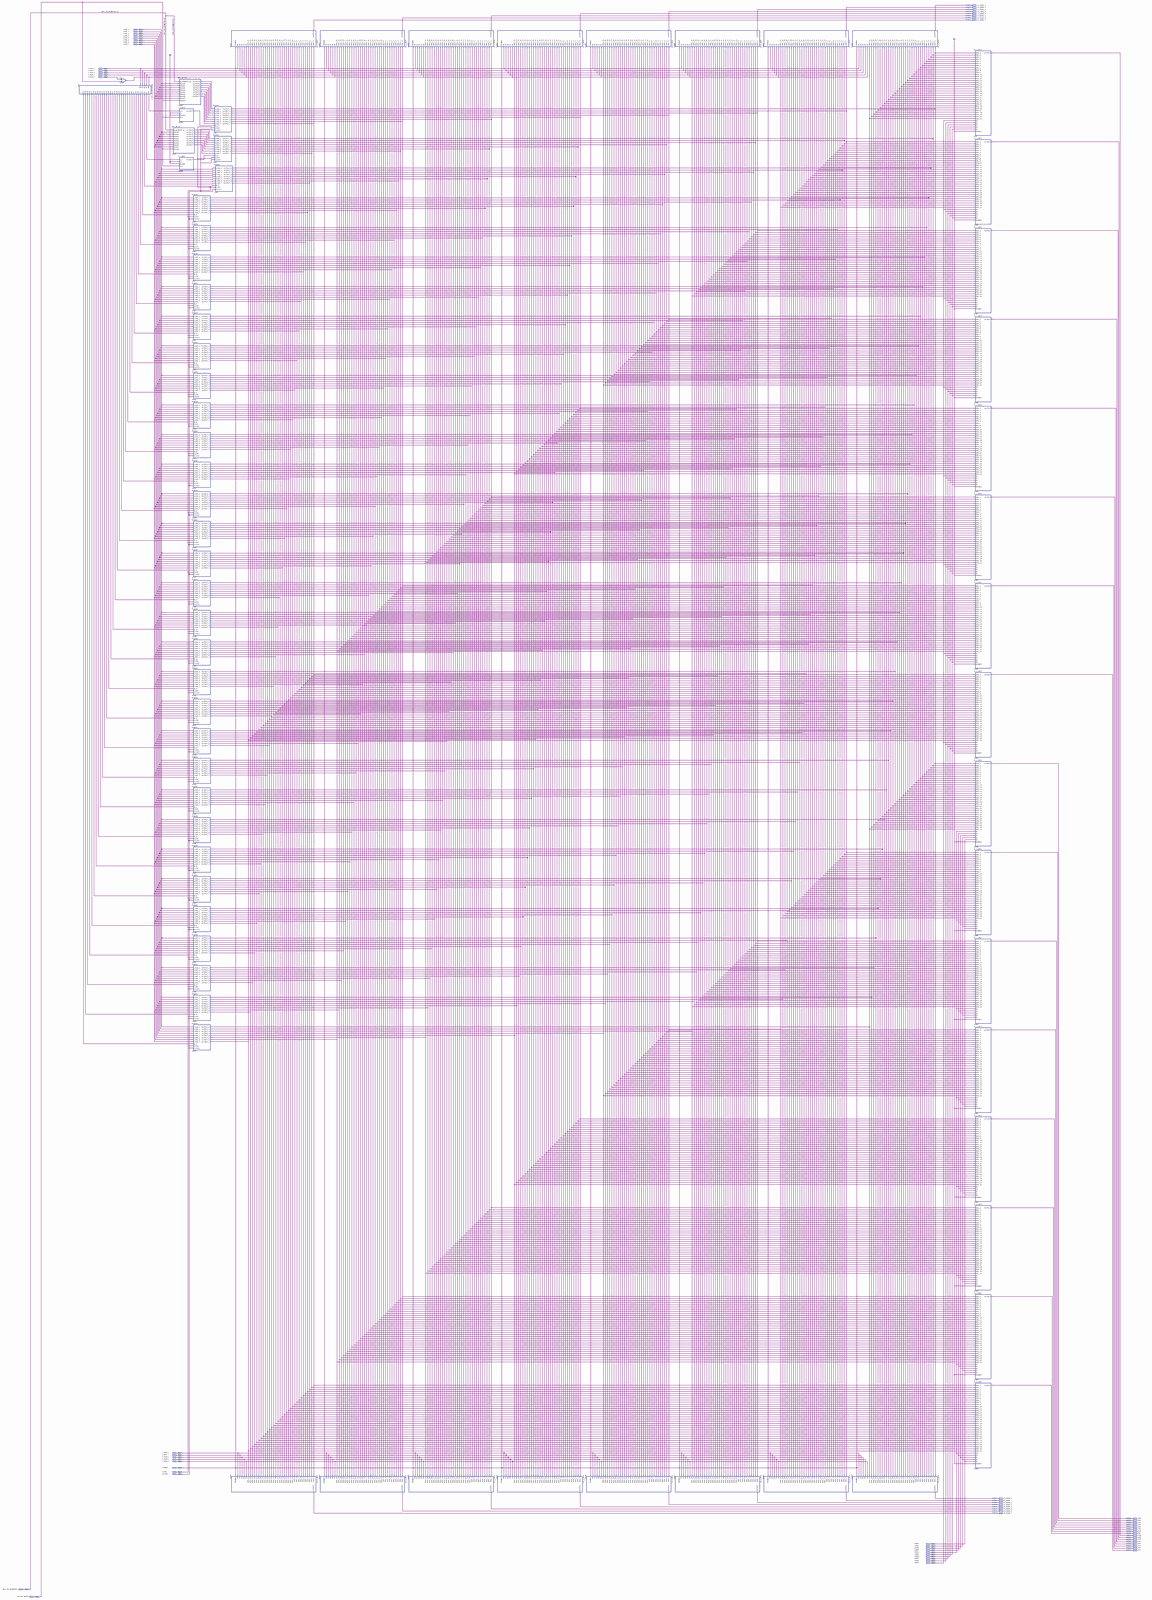
[diagram p0: schematic sheet, whole]
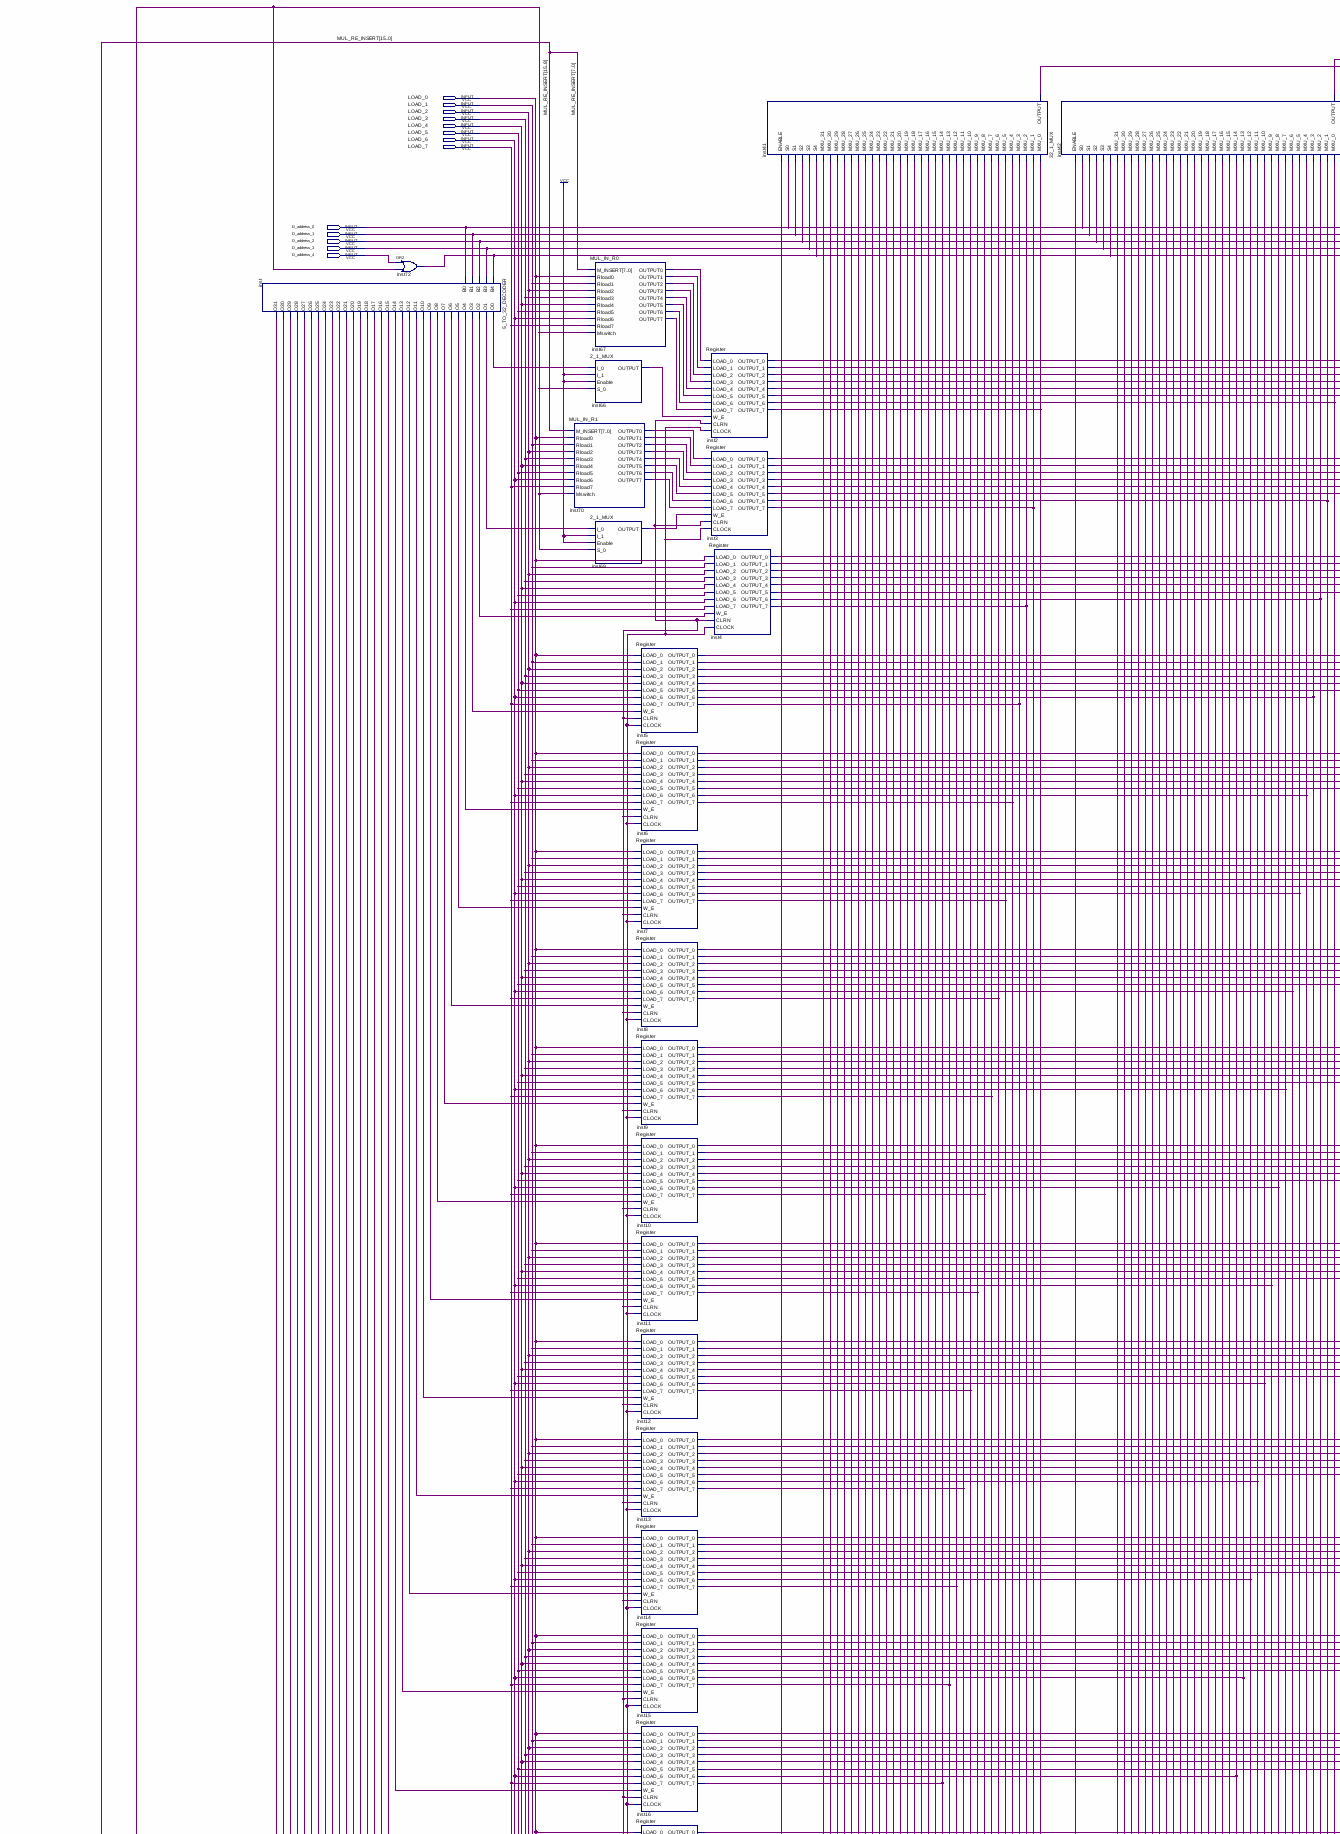
[diagram p1: schematic sheet, upper left part]
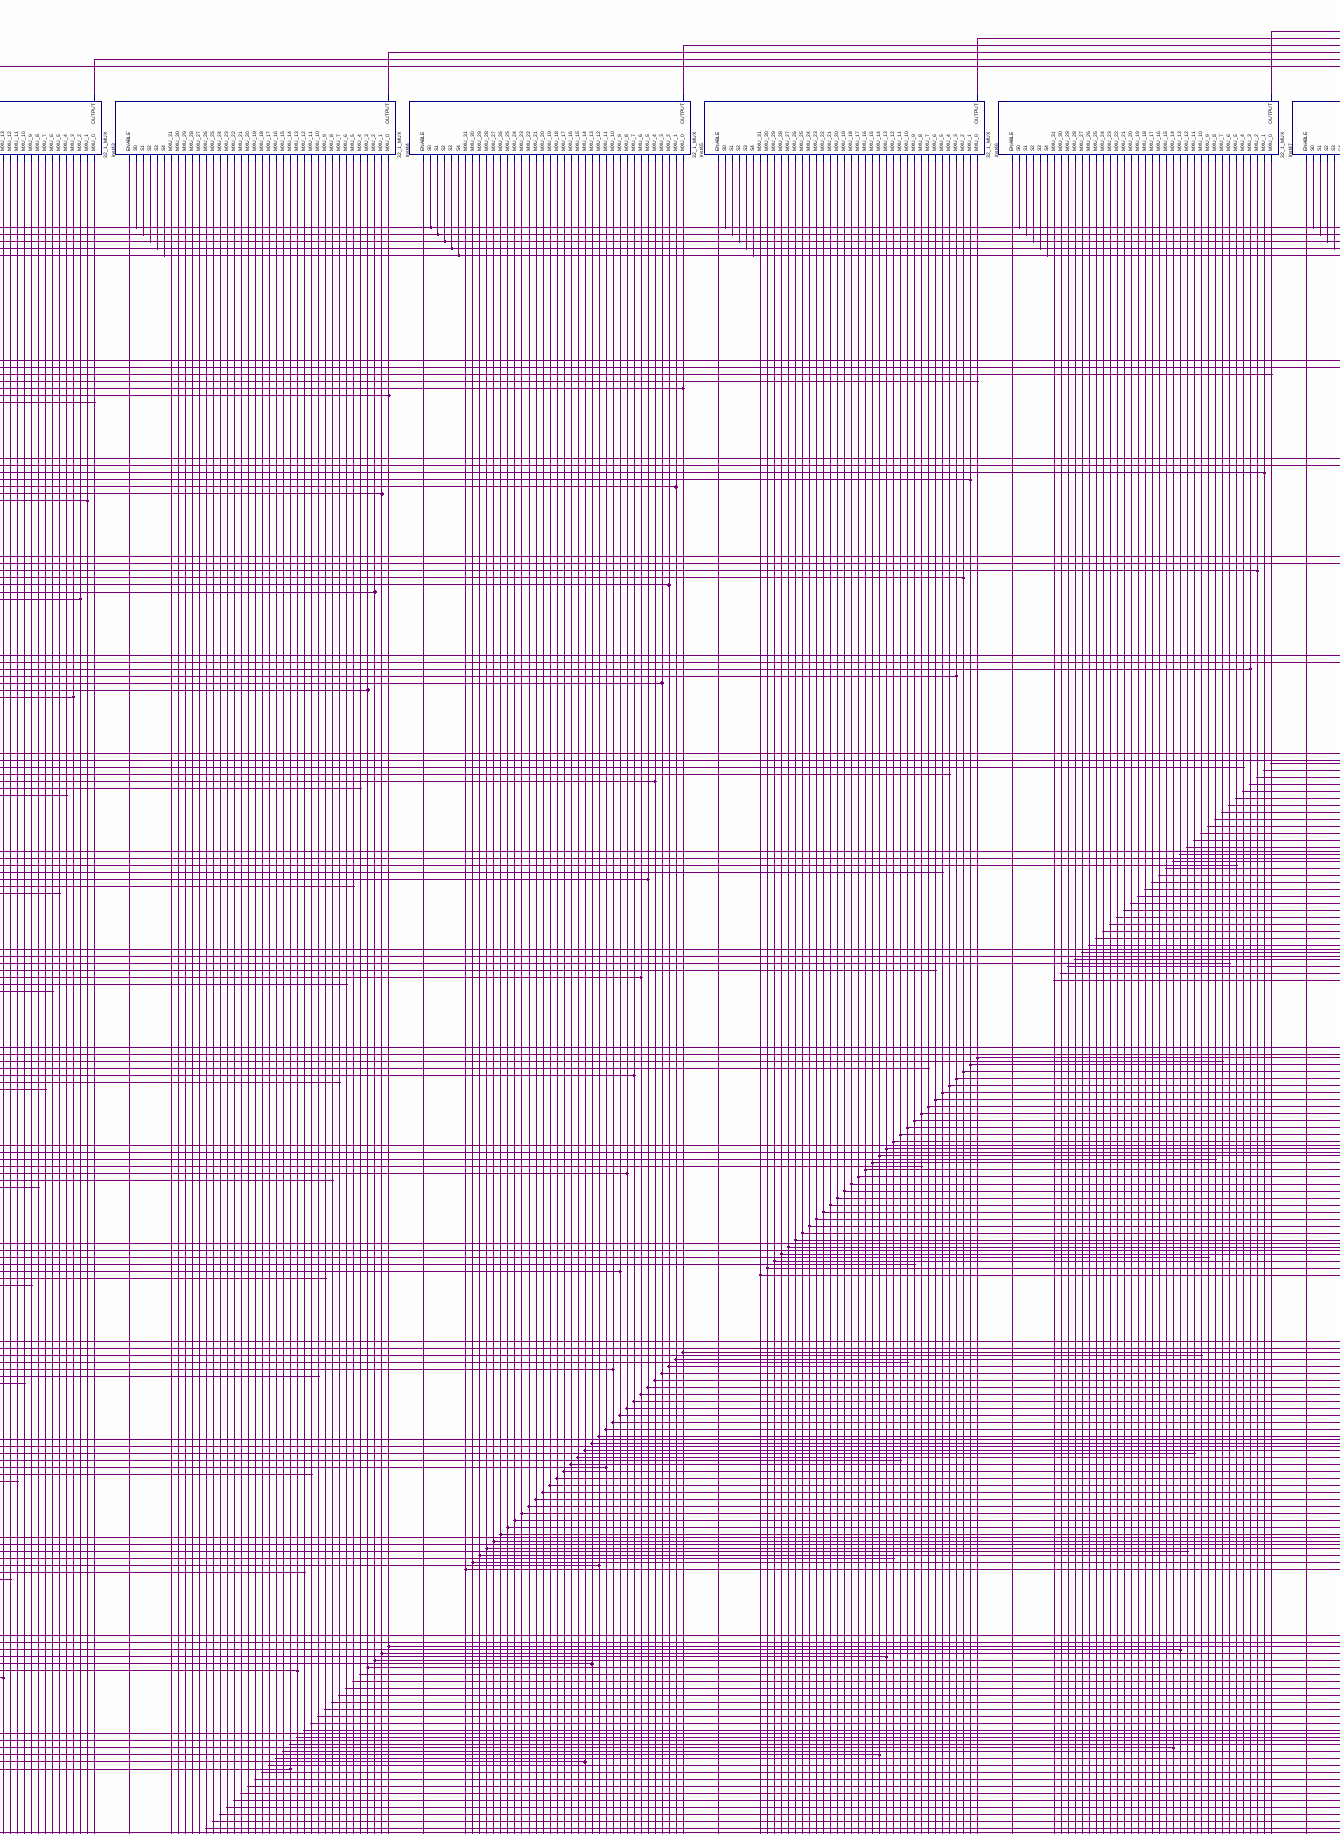
[diagram p2: schematic sheet, upper centre part]
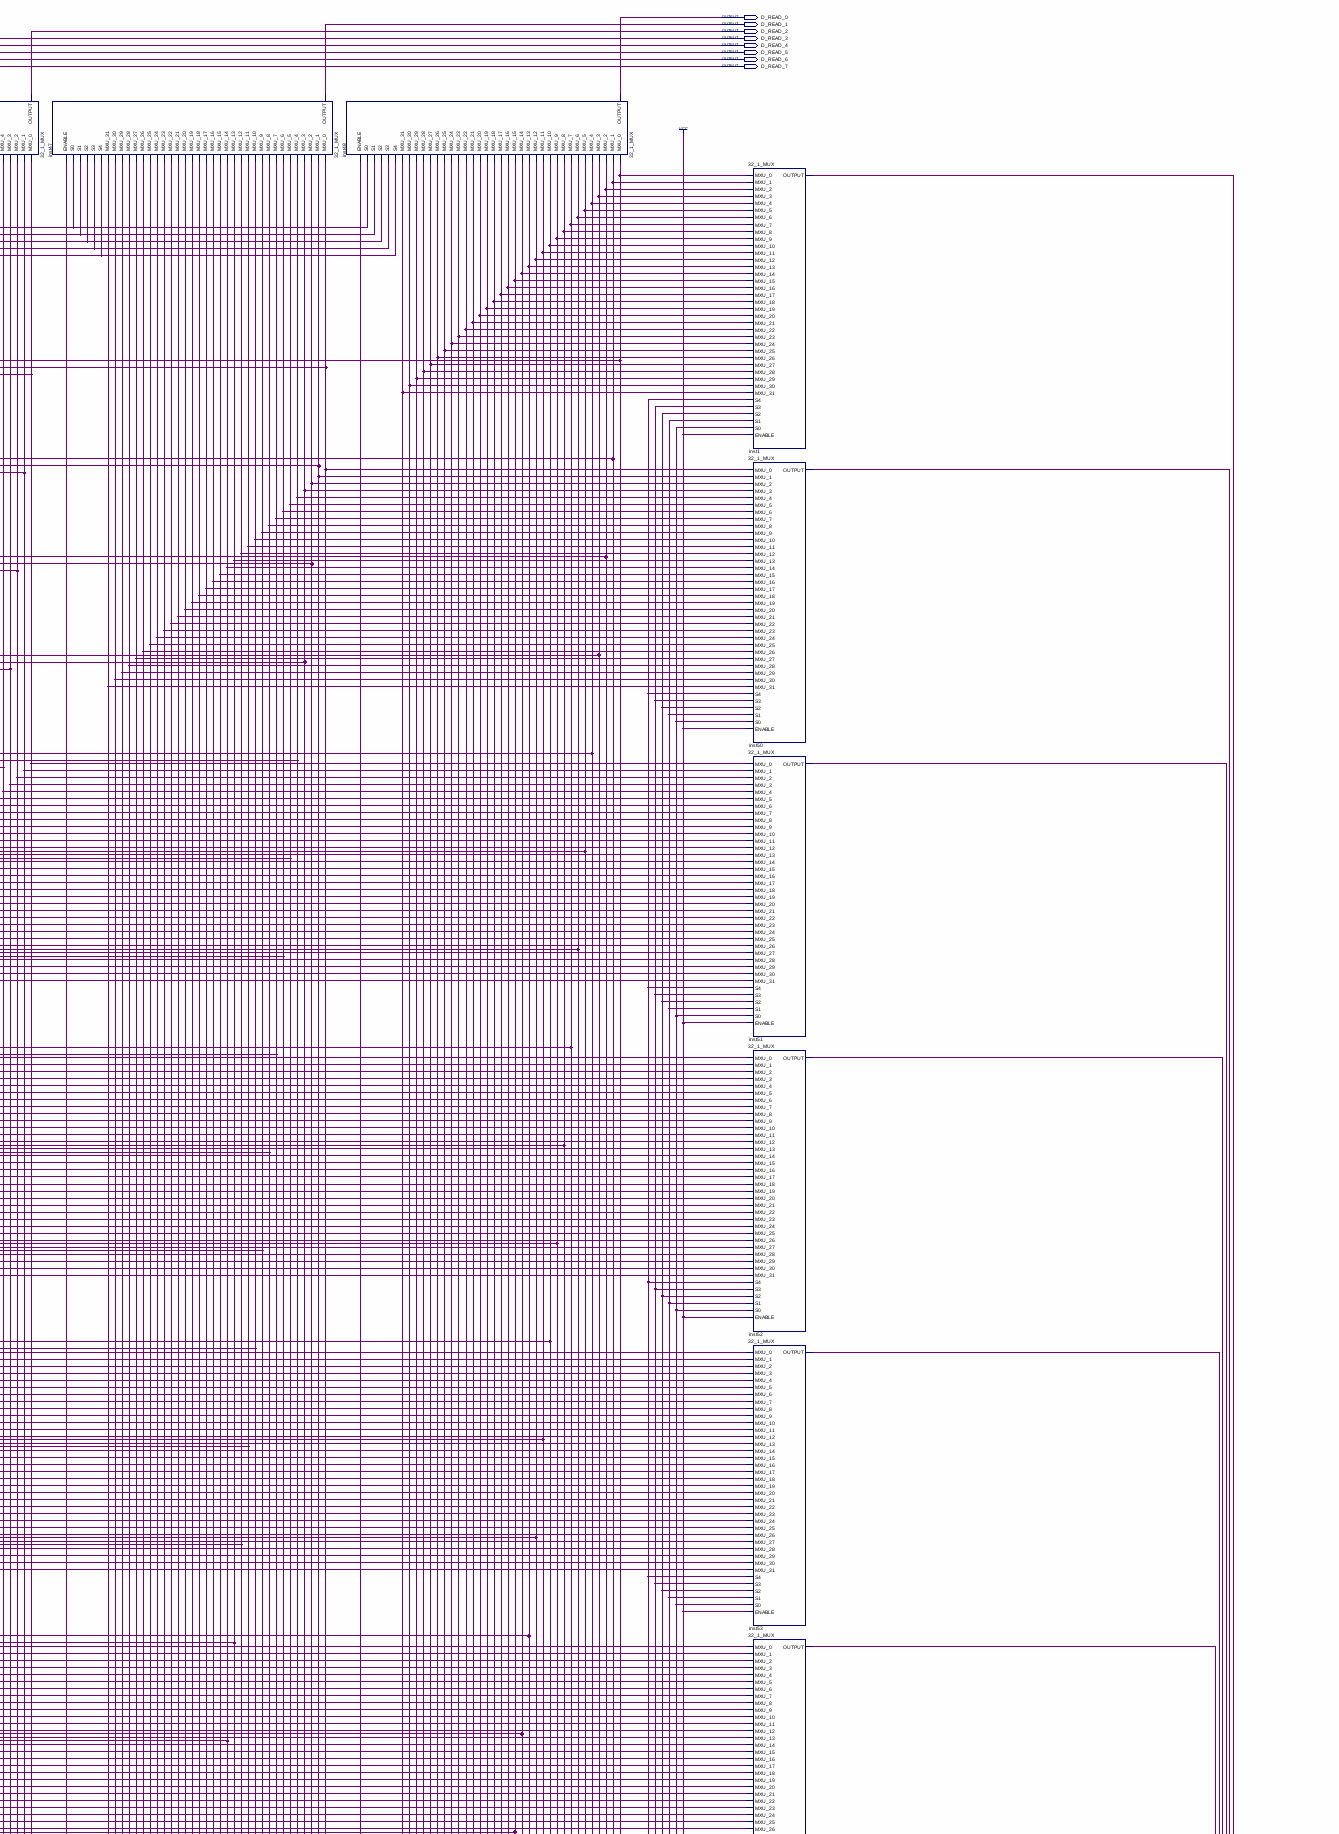
[diagram p3: schematic sheet, upper right part]
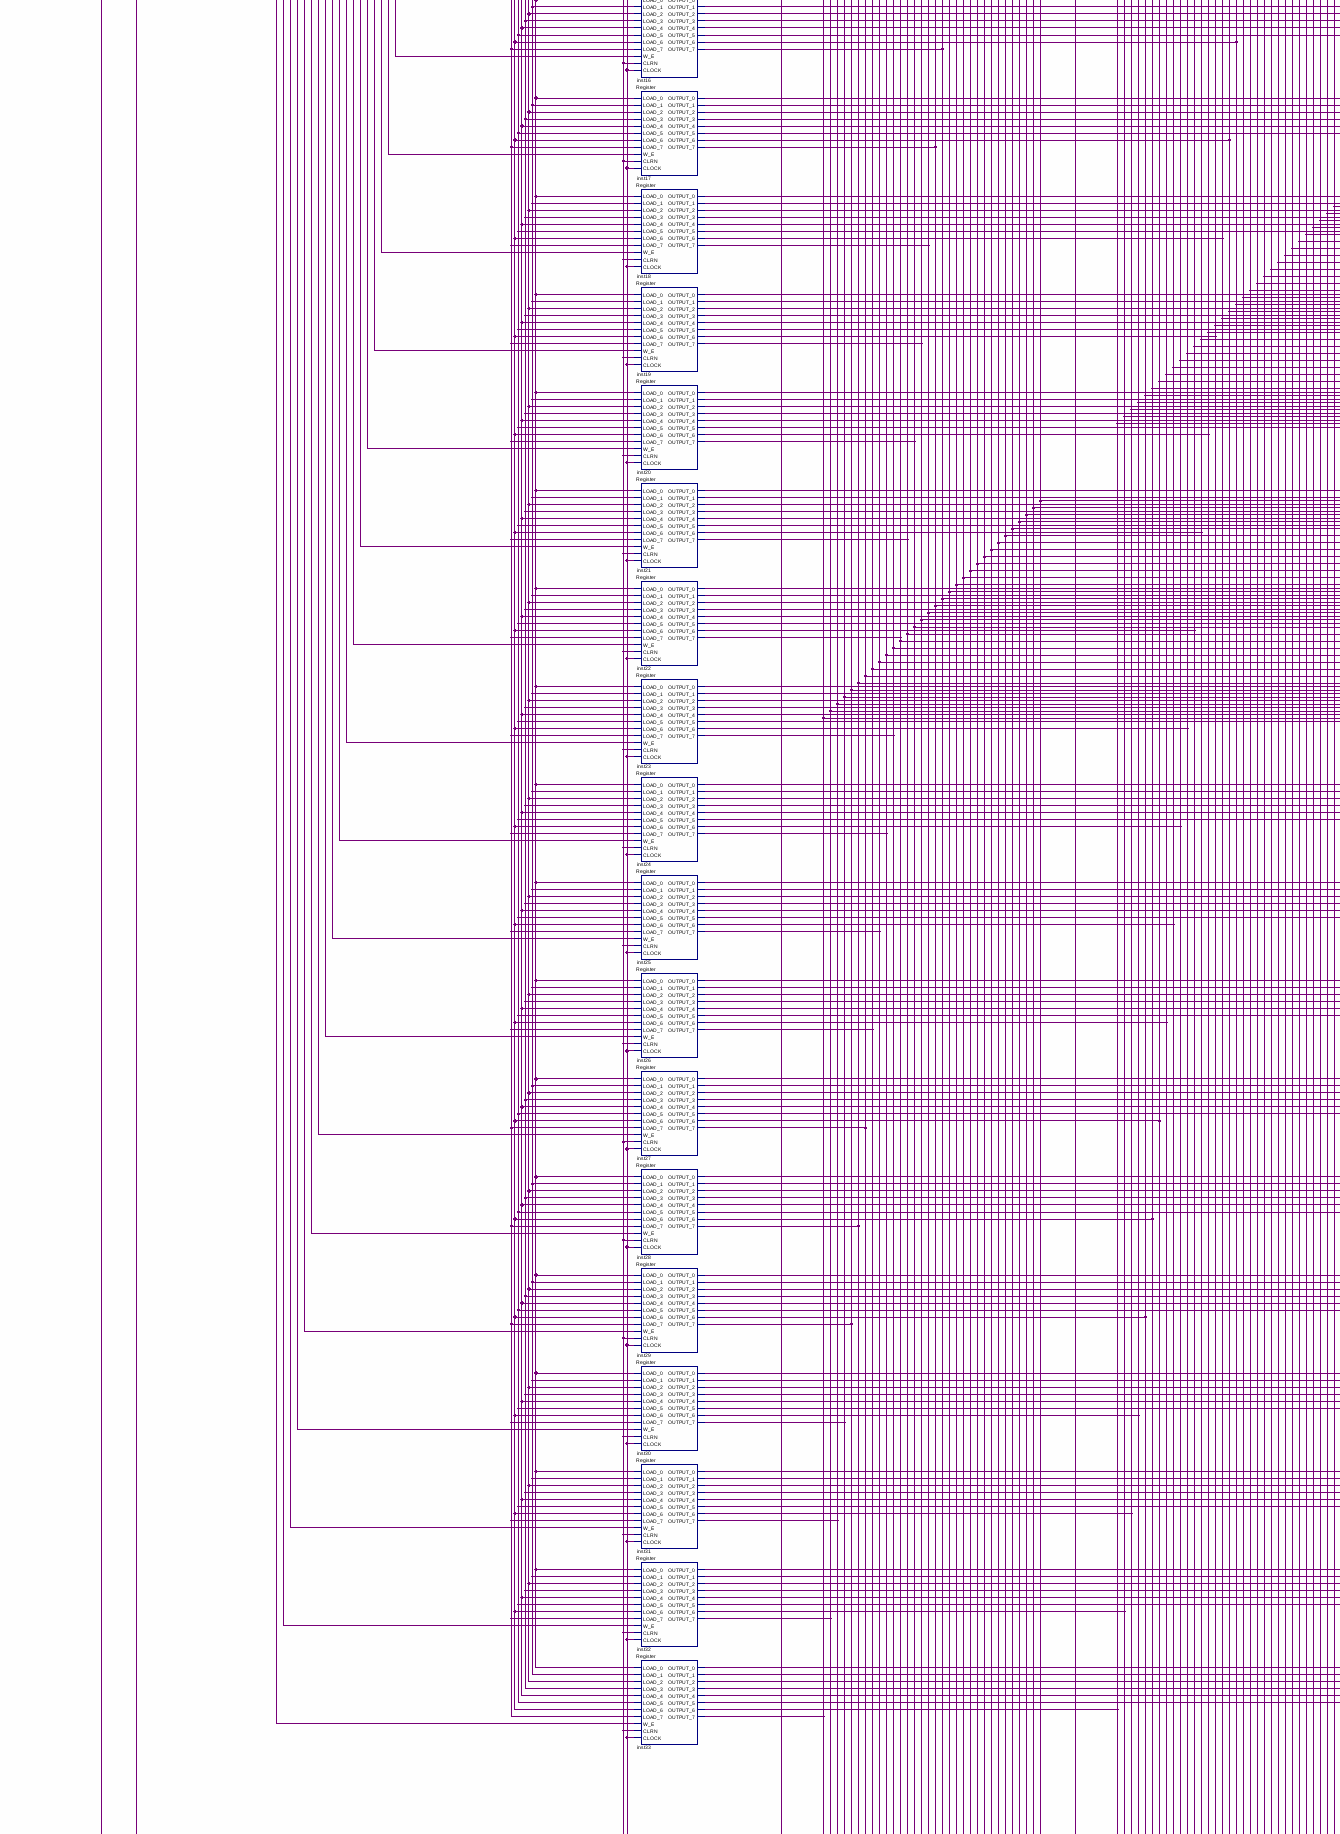
[diagram p4: schematic sheet, middle left part]
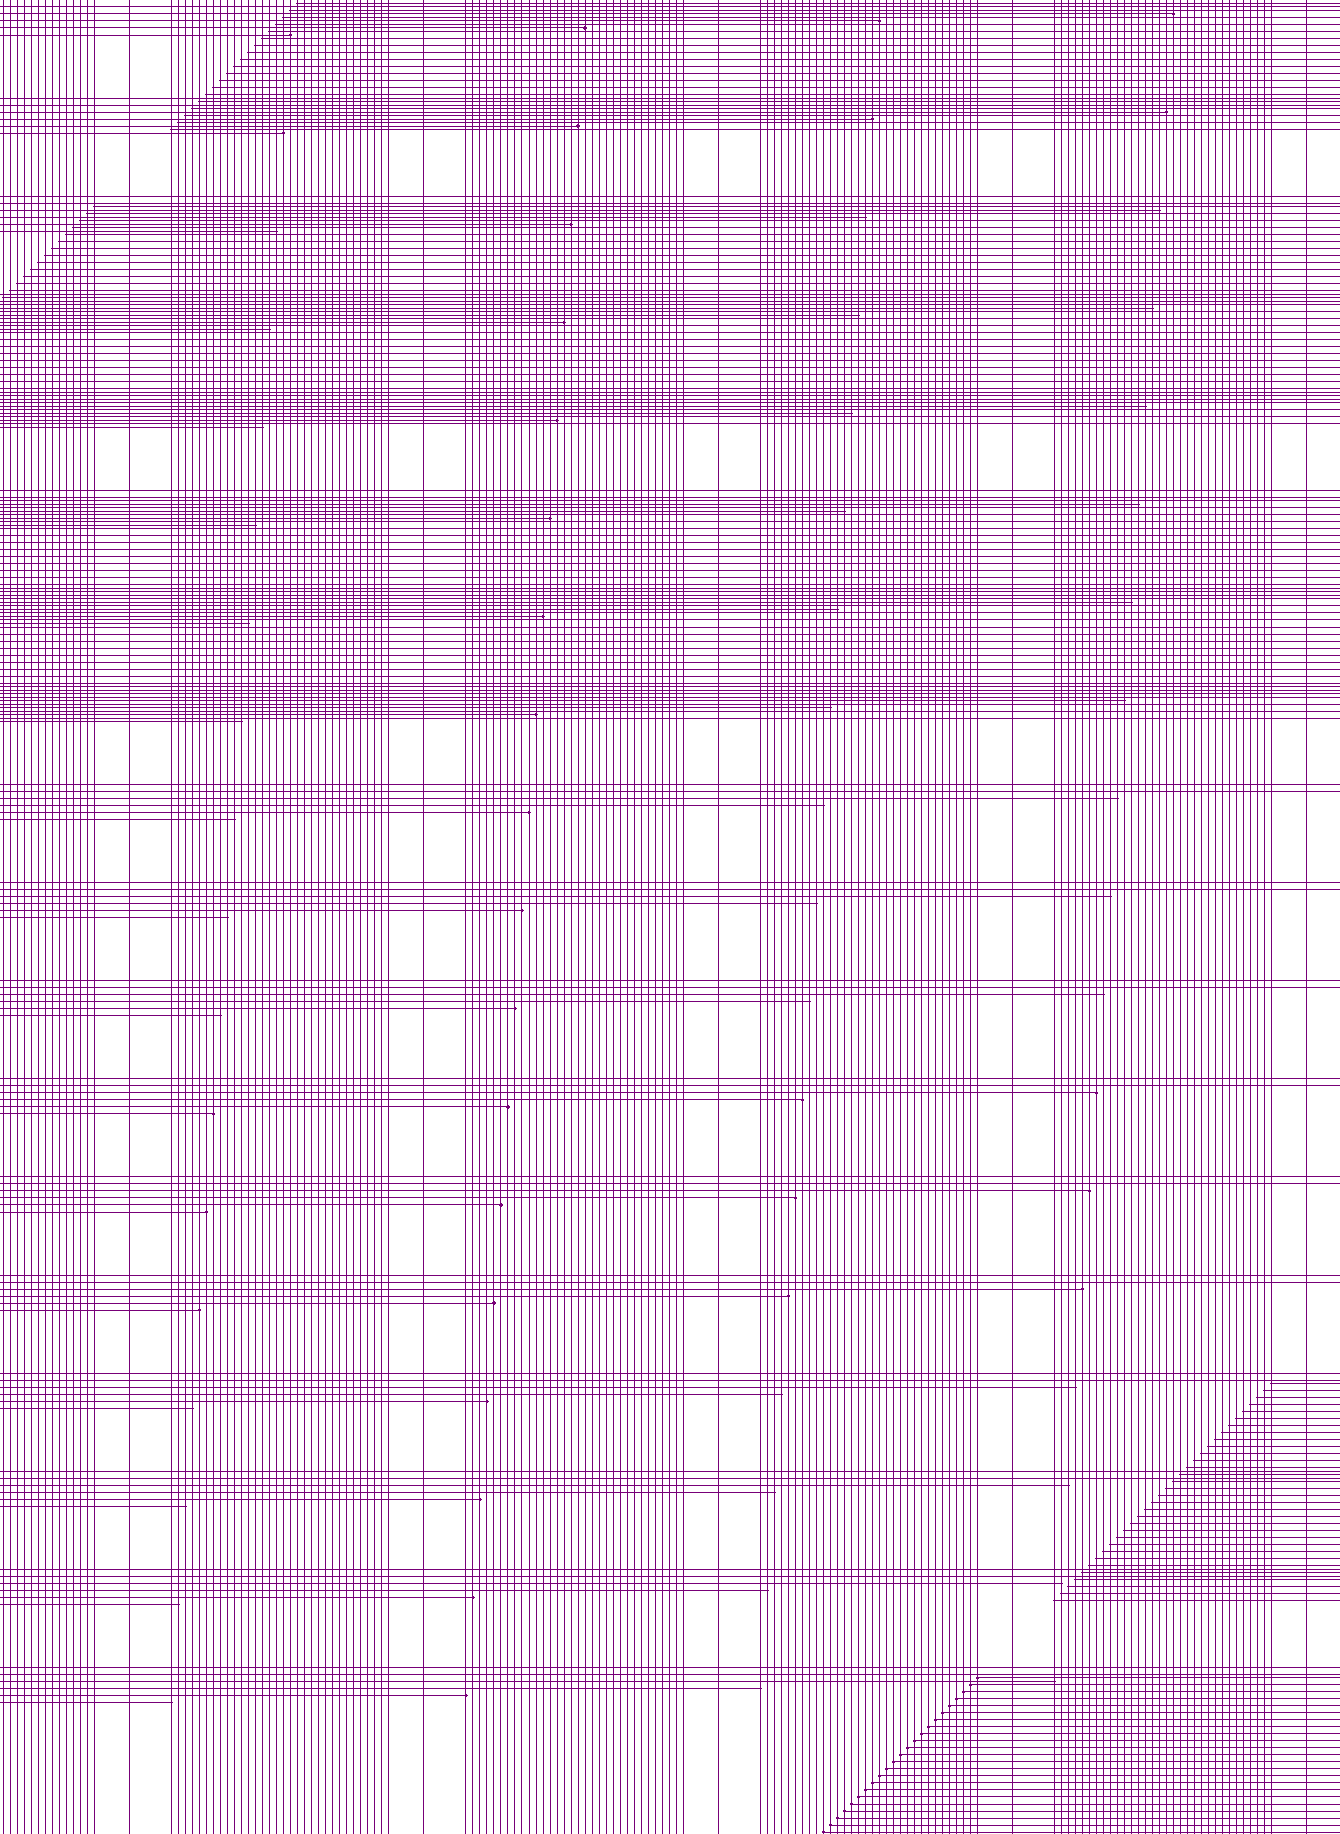
[diagram p5: schematic sheet, middle centre part]
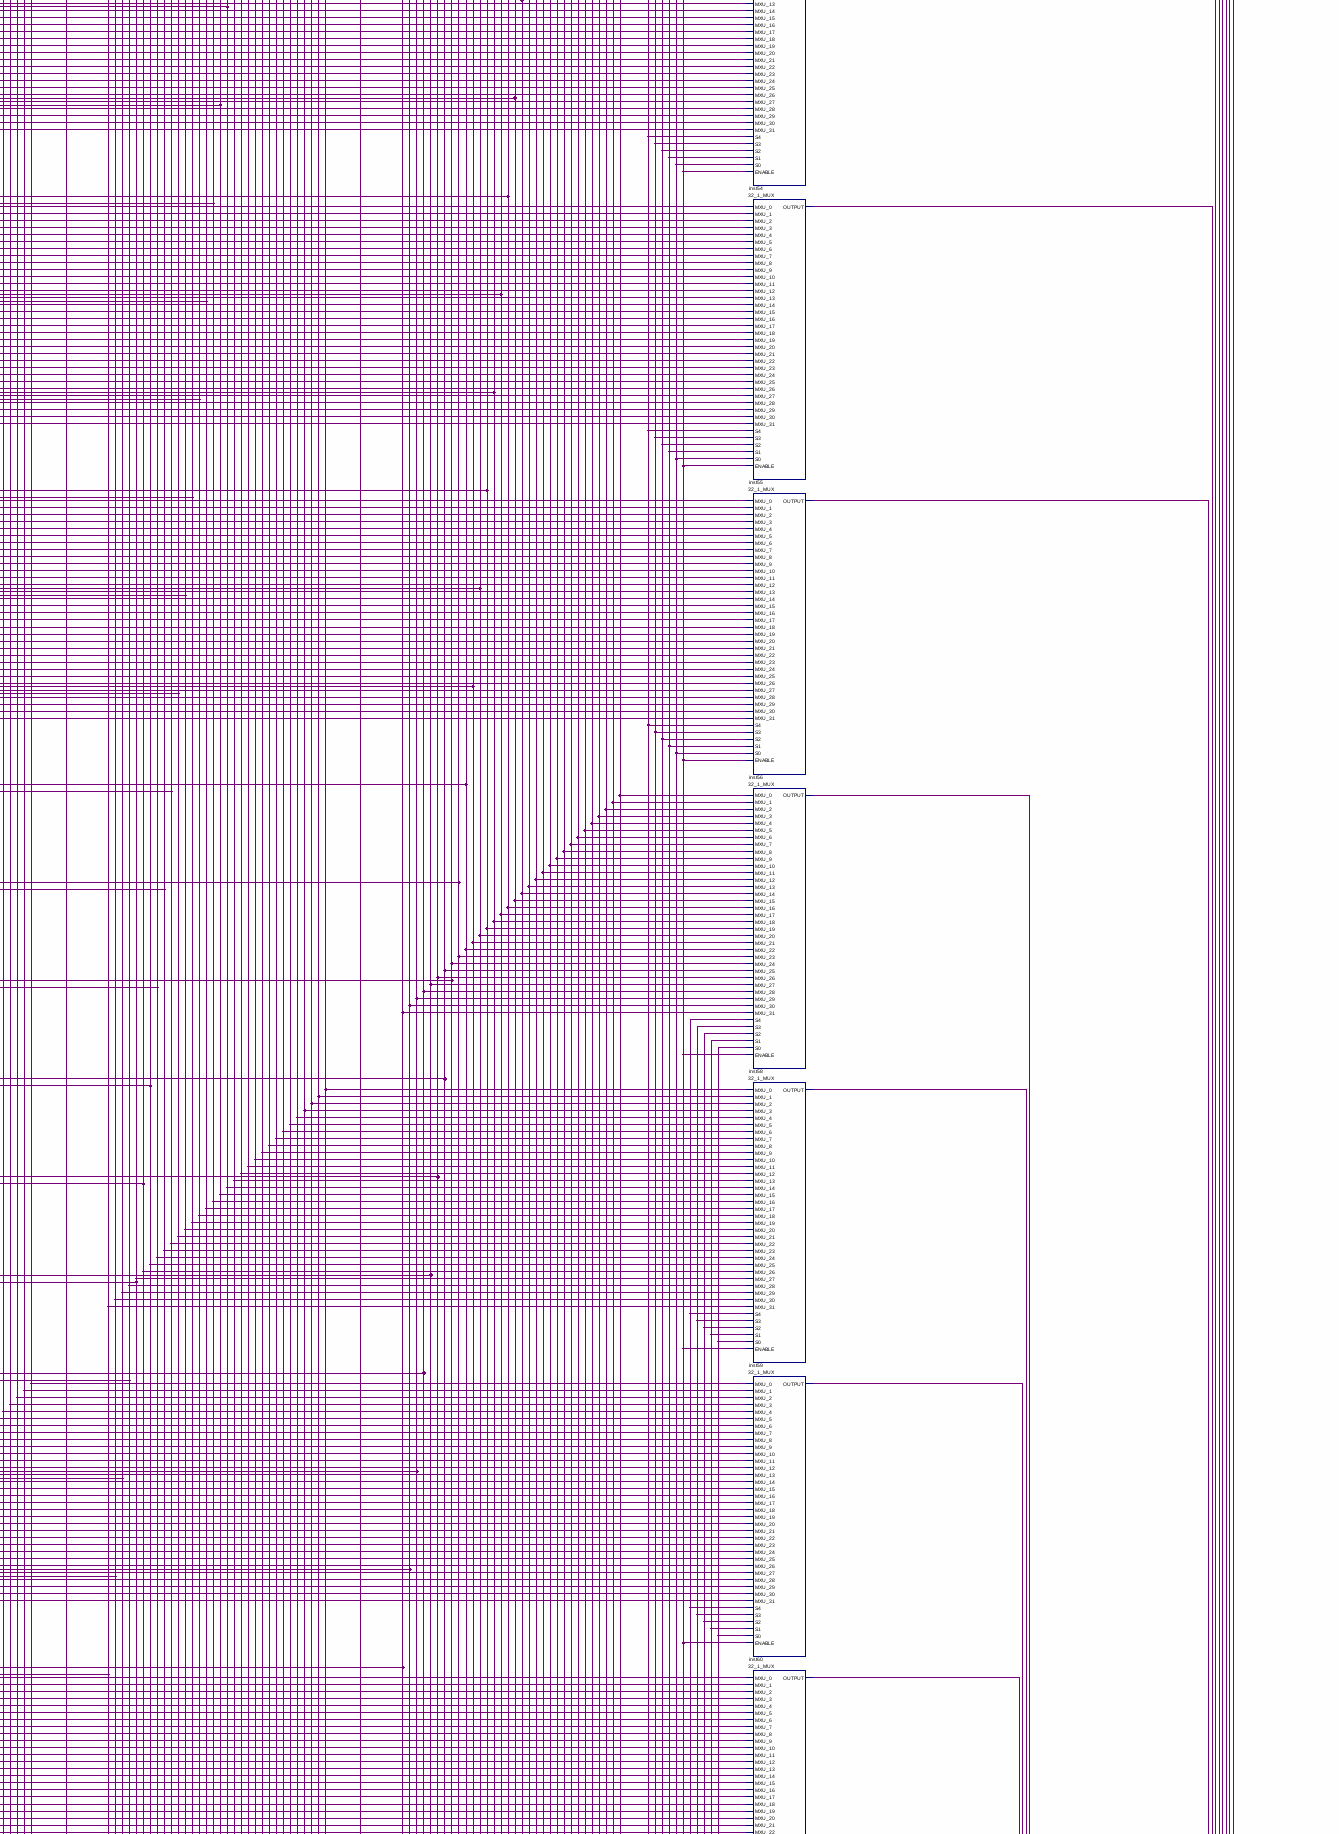
[diagram p6: schematic sheet, middle right part]
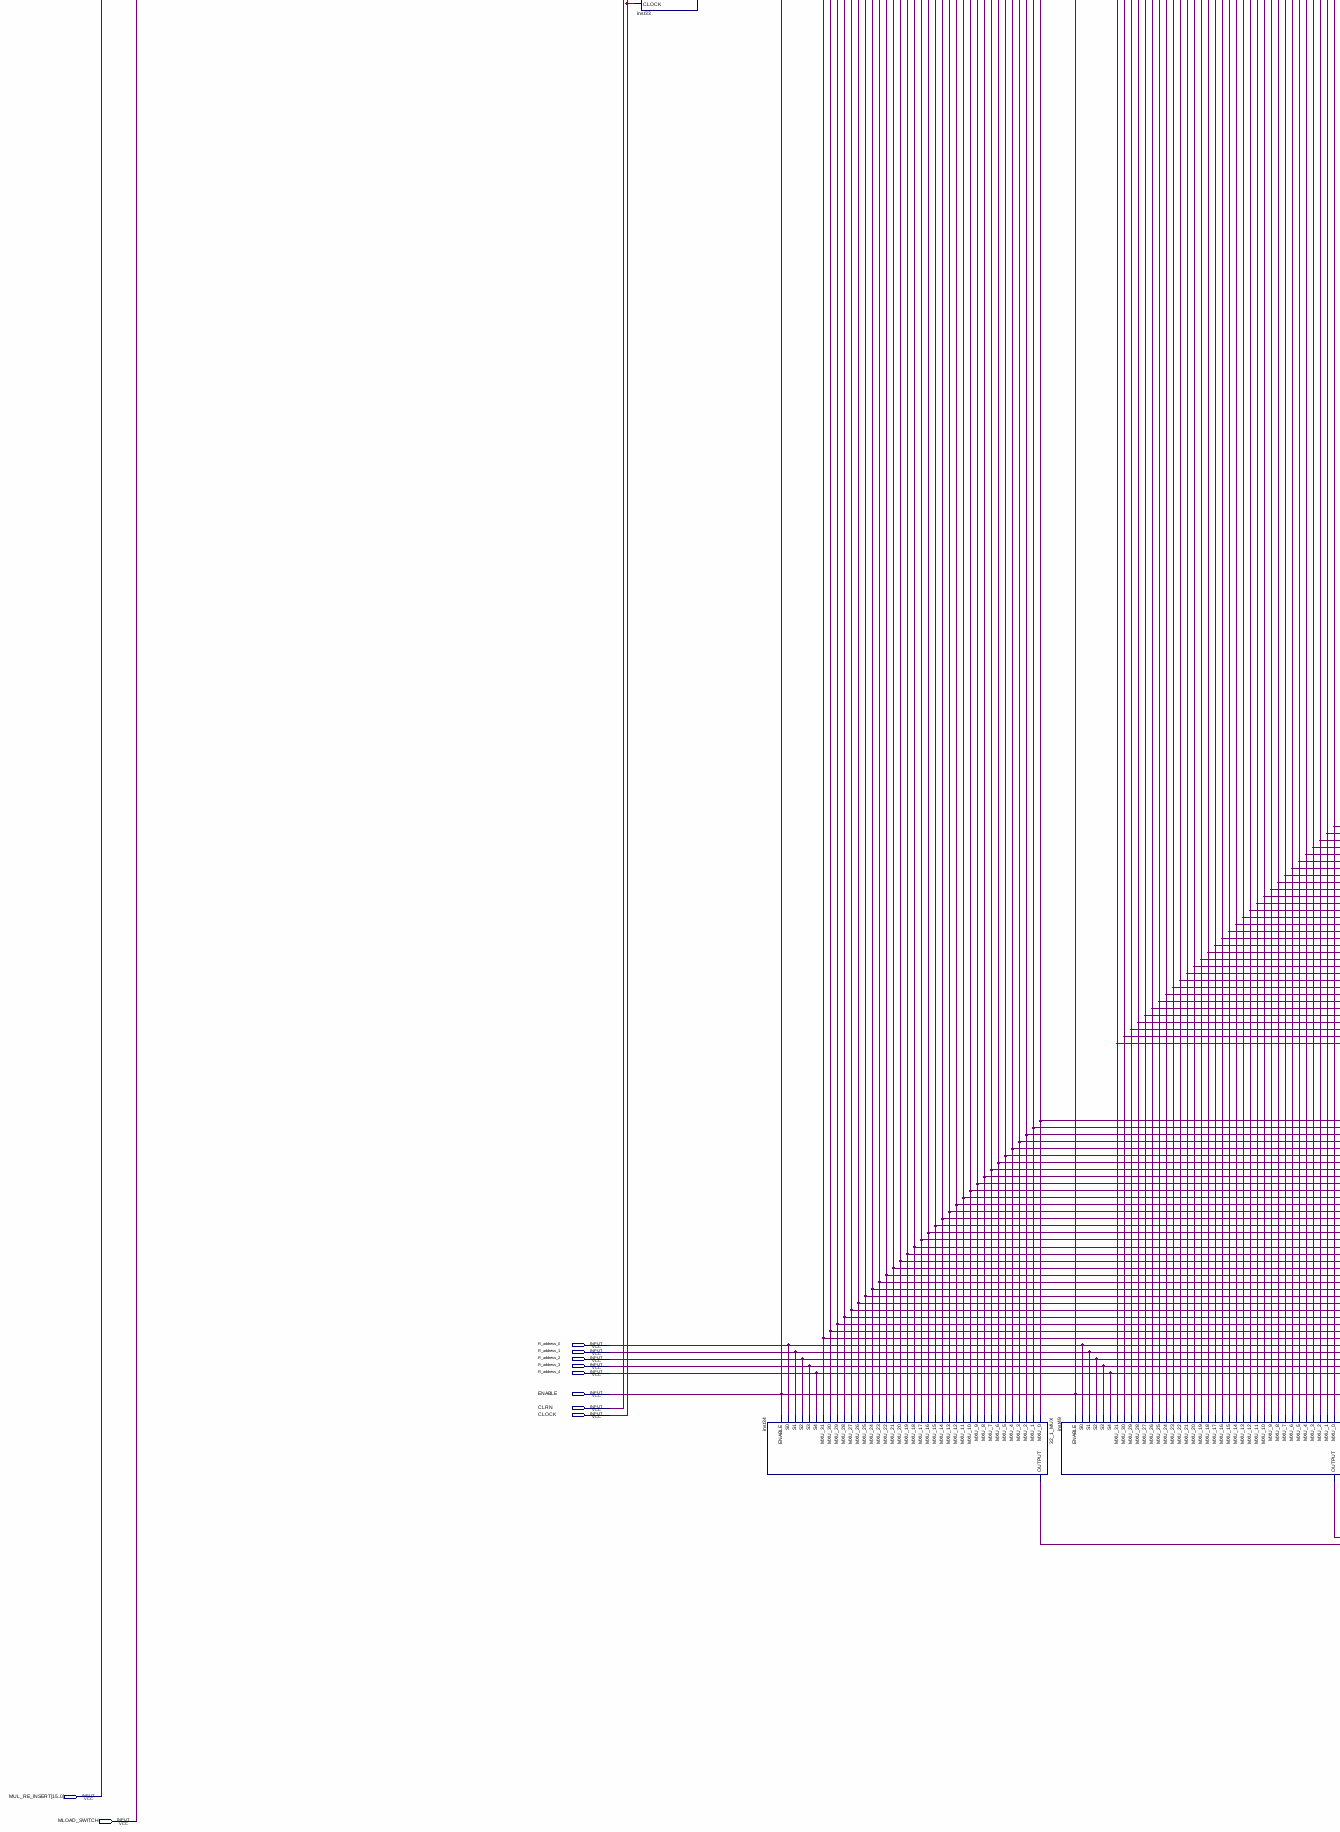
[diagram p7: schematic sheet, lower left part]
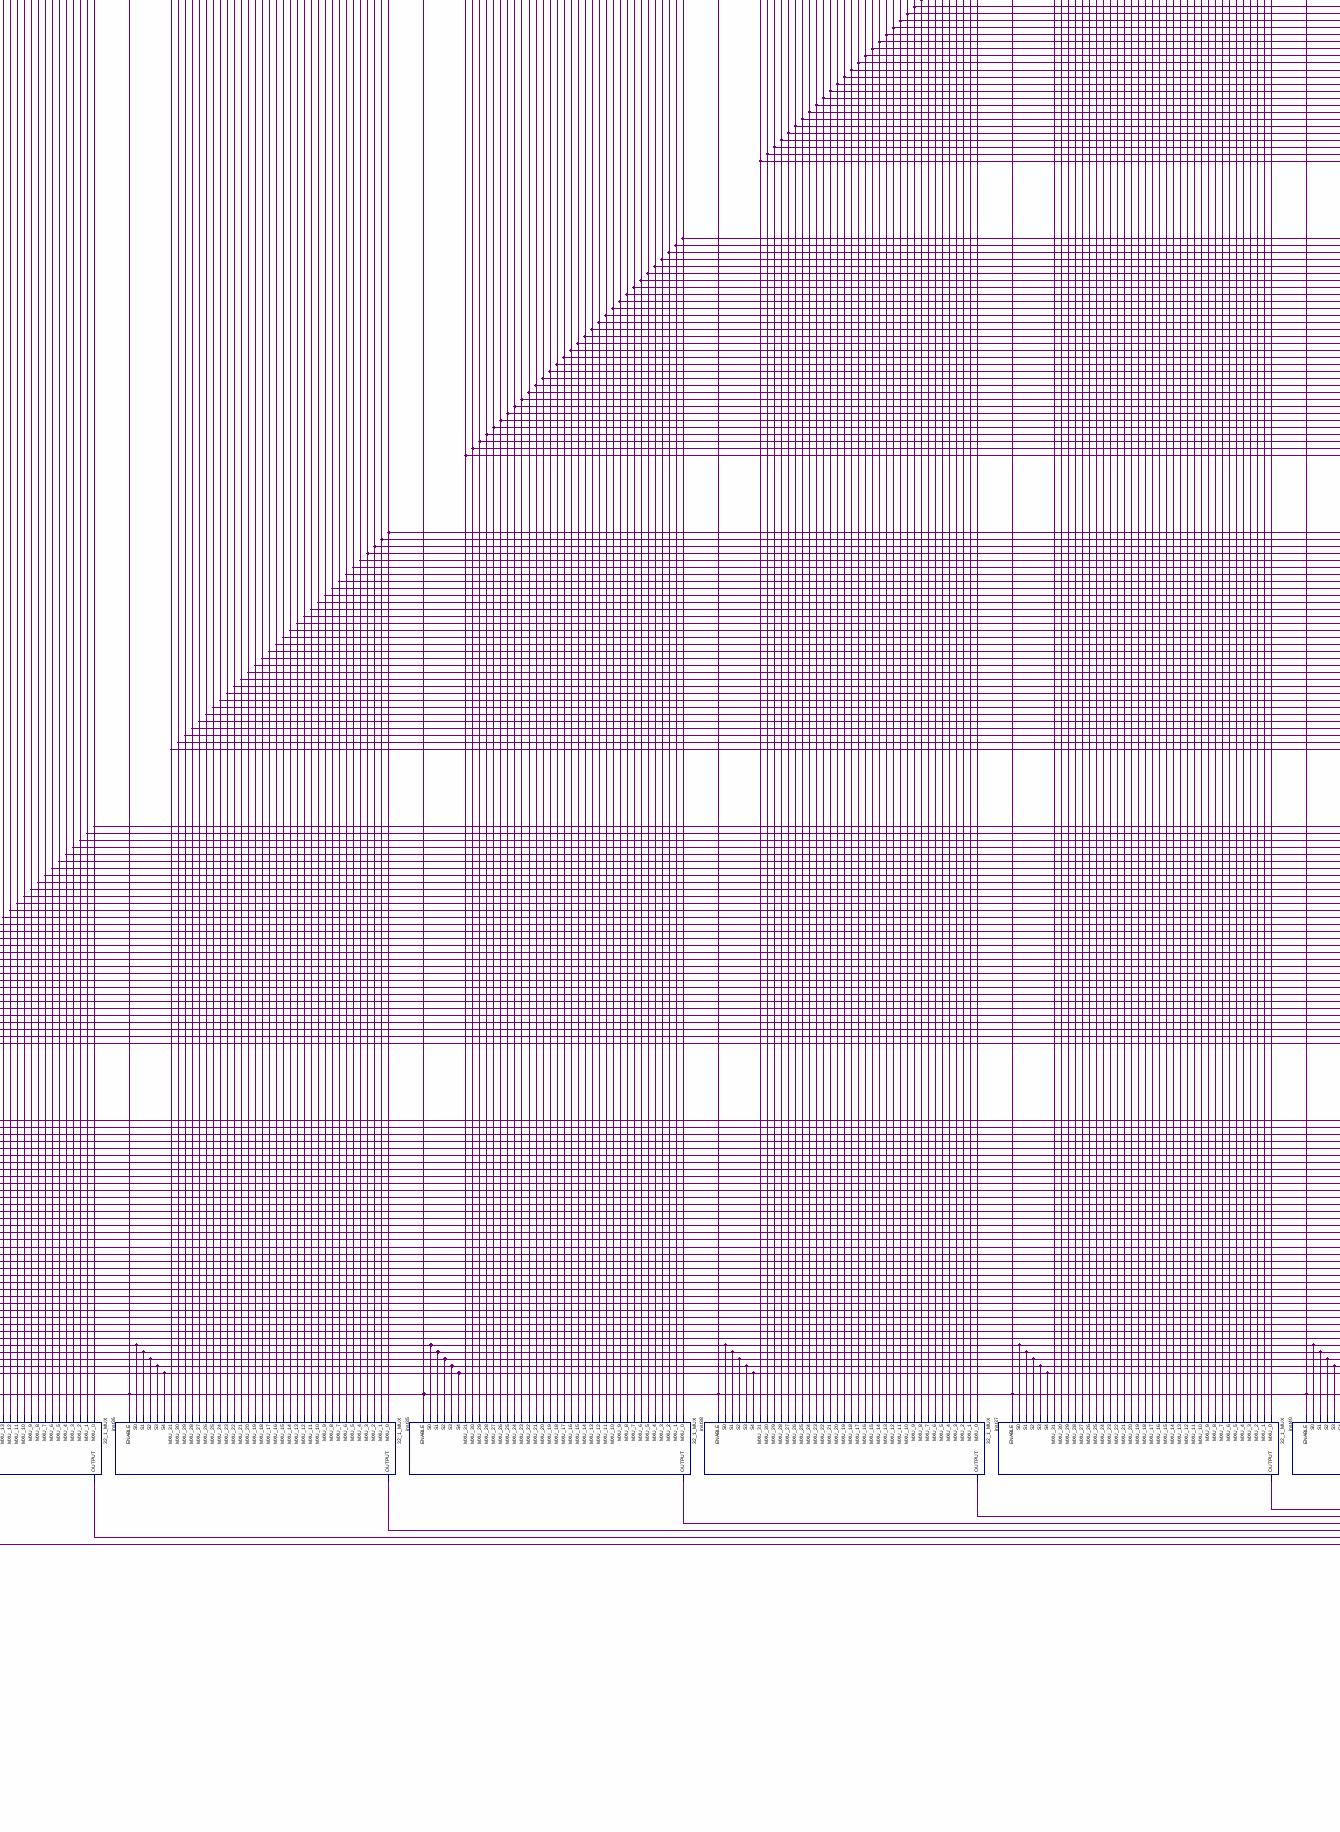
[diagram p8: schematic sheet, lower centre part]
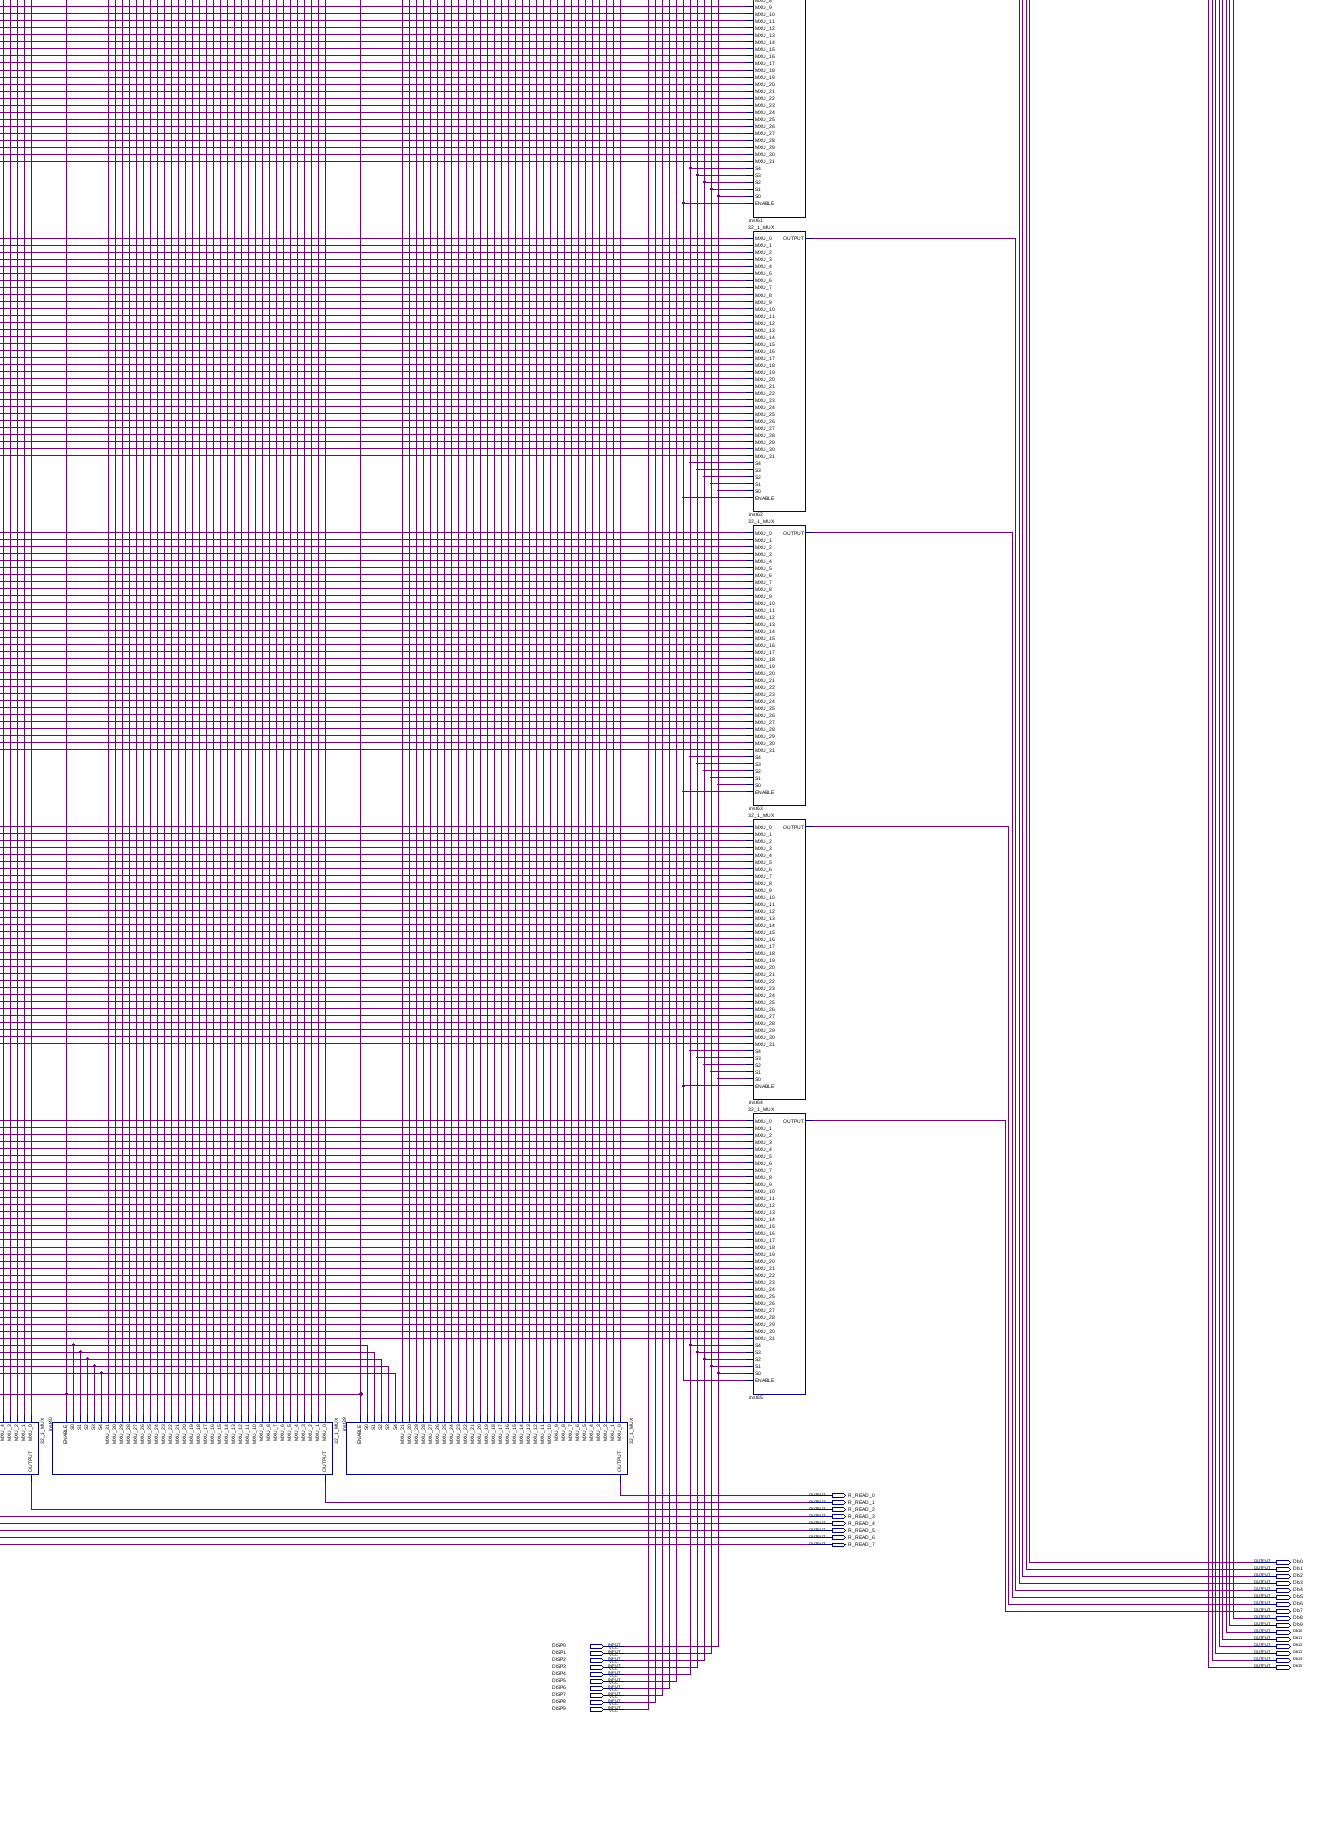
[diagram p9: schematic sheet, lower right part]
// Quartus schematic Register_File.bdf as structural Verilog: 70 symbols, 65 pins
module Register_File (
  input  LOAD_0,
  input  LOAD_1,
  input  LOAD_2,
  input  LOAD_3,
  input  LOAD_4,
  input  LOAD_5,
  input  LOAD_6,
  input  LOAD_7,
  input  D_address_0,
  input  D_address_1,
  input  D_address_2,
  input  D_address_3,
  input  D_address_4,
  input  R_address_0,
  input  R_address_1,
  input  R_address_2,
  input  R_address_3,
  input  R_address_4,
  input  ENABLE,
  input  CLRN,
  input  CLOCK,
  input  DISP0,
  input  DISP1,
  input  DISP2,
  input  DISP3,
  input  DISP4,
  input  DISP5,
  input  DISP6,
  input  DISP7,
  input  DISP8,
  input  DISP9,
  input  [15:0] MUL_RE_INSERT,
  input  MLOAD_SWITCH,
  output D_READ_0,
  output D_READ_1,
  output D_READ_2,
  output D_READ_3,
  output D_READ_4,
  output D_READ_5,
  output D_READ_6,
  output D_READ_7,
  output R_READ_0,
  output R_READ_1,
  output R_READ_2,
  output R_READ_3,
  output R_READ_4,
  output R_READ_5,
  output R_READ_6,
  output R_READ_7,
  output Db0,
  output Db1,
  output Db2,
  output Db3,
  output Db4,
  output Db5,
  output Db6,
  output Db7,
  output Db8,
  output Db9,
  output Db10,
  output Db11,
  output Db12,
  output Db13,
  output Db14,
  output Db15
);

  wire inst2_output_0, inst2_output_1, inst2_output_2, inst2_output_3, inst2_output_4, inst2_output_5,
       inst2_output_6, inst2_output_7, inst3_output_0, inst3_output_1, inst3_output_2, inst3_output_3,
       inst3_output_4, inst3_output_5, inst3_output_6, inst3_output_7, inst4_output_0, inst4_output_1,
       inst4_output_2, inst4_output_3, inst4_output_4, inst4_output_5, inst4_output_6, inst4_output_7,
       inst5_output_0, inst5_output_1, inst5_output_2, inst5_output_3, inst5_output_4, inst5_output_5,
       inst5_output_6, inst5_output_7, inst6_output_0, inst6_output_1, inst6_output_2, inst6_output_3,
       inst6_output_4, inst6_output_5, inst6_output_6, inst6_output_7, inst7_output_0, inst7_output_1,
       inst7_output_2, inst7_output_3, inst7_output_4, inst7_output_5, inst7_output_6, inst7_output_7,
       inst8_output_0, inst8_output_1, inst8_output_2, inst8_output_3, inst8_output_4, inst8_output_5,
       inst8_output_6, inst8_output_7, inst9_output_0, inst9_output_1, inst9_output_2, inst9_output_3,
       inst9_output_4, inst9_output_5, inst9_output_6, inst9_output_7, inst10_output_0, inst10_output_1,
       inst10_output_2, inst10_output_3, inst10_output_4, inst10_output_5, inst10_output_6, inst10_output_7,
       inst11_output_0, inst11_output_1, inst11_output_2, inst11_output_3, inst11_output_4, inst11_output_5,
       inst11_output_6, inst11_output_7, inst12_output_0, inst12_output_1, inst12_output_2, inst12_output_3,
       inst12_output_4, inst12_output_5, inst12_output_6, inst12_output_7, inst13_output_0, inst13_output_1,
       inst13_output_2, inst13_output_3, inst13_output_4, inst13_output_5, inst13_output_6, inst13_output_7,
       inst14_output_0, inst14_output_1, inst14_output_2, inst14_output_3, inst14_output_4, inst14_output_5,
       inst14_output_6, inst14_output_7, inst15_output_0, inst15_output_1, inst15_output_2, inst15_output_3,
       inst15_output_4, inst15_output_5, inst15_output_6, inst15_output_7, inst16_output_0, inst16_output_1,
       inst16_output_2, inst16_output_3, inst16_output_4, inst16_output_5, inst16_output_6, inst16_output_7,
       inst17_output_0, inst17_output_1, inst17_output_2, inst17_output_3, inst17_output_4, inst17_output_5,
       inst17_output_6, inst17_output_7, inst18_output_0, inst18_output_1, inst18_output_2, inst18_output_3,
       inst18_output_4, inst18_output_5, inst18_output_6, inst18_output_7, inst19_output_0, inst19_output_1,
       inst19_output_2, inst19_output_3, inst19_output_4, inst19_output_5, inst19_output_6, inst19_output_7,
       inst20_output_0, inst20_output_1, inst20_output_2, inst20_output_3, inst20_output_4, inst20_output_5,
       inst20_output_6, inst20_output_7, inst21_output_0, inst21_output_1, inst21_output_2, inst21_output_3,
       inst21_output_4, inst21_output_5, inst21_output_6, inst21_output_7, inst22_output_0, inst22_output_1,
       inst22_output_2, inst22_output_3, inst22_output_4, inst22_output_5, inst22_output_6, inst22_output_7,
       inst23_output_0, inst23_output_1, inst23_output_2, inst23_output_3, inst23_output_4, inst23_output_5,
       inst23_output_6, inst23_output_7, inst24_output_0, inst24_output_1, inst24_output_2, inst24_output_3,
       inst24_output_4, inst24_output_5, inst24_output_6, inst24_output_7, inst25_output_0, inst25_output_1,
       inst25_output_2, inst25_output_3, inst25_output_4, inst25_output_5, inst25_output_6, inst25_output_7,
       inst26_output_0, inst26_output_1, inst26_output_2, inst26_output_3, inst26_output_4, inst26_output_5,
       inst26_output_6, inst26_output_7, inst27_output_0, inst27_output_1, inst27_output_2, inst27_output_3,
       inst27_output_4, inst27_output_5, inst27_output_6, inst27_output_7, inst28_output_0, inst28_output_1,
       inst28_output_2, inst28_output_3, inst28_output_4, inst28_output_5, inst28_output_6, inst28_output_7,
       inst29_output_0, inst29_output_1, inst29_output_2, inst29_output_3, inst29_output_4, inst29_output_5,
       inst29_output_6, inst29_output_7, inst30_output_0, inst30_output_1, inst30_output_2, inst30_output_3,
       inst30_output_4, inst30_output_5, inst30_output_6, inst30_output_7, inst31_output_0, inst31_output_1,
       inst31_output_2, inst31_output_3, inst31_output_4, inst31_output_5, inst31_output_6, inst31_output_7,
       inst32_output_0, inst32_output_1, inst32_output_2, inst32_output_3, inst32_output_4, inst32_output_5,
       inst32_output_6, inst32_output_7, inst33_output_0, inst33_output_1, inst33_output_2, inst33_output_3,
       inst33_output_4, inst33_output_5, inst33_output_6, inst33_output_7, inst66_output, inst67_output0,
       inst67_output1, inst67_output2, inst67_output3, inst67_output4, inst67_output5, inst67_output6,
       inst67_output7, inst69_output, inst70_output0, inst70_output1, inst70_output2, inst70_output3,
       inst70_output4, inst70_output5, inst70_output6, inst70_output7, inst72_out, inst_o0, inst_o1, inst_o2,
       inst_o3, inst_o4, inst_o5, inst_o6, inst_o7, inst_o8, inst_o9, inst_o10, inst_o11, inst_o12, inst_o13,
       inst_o14, inst_o15, inst_o16, inst_o17, inst_o18, inst_o19, inst_o20, inst_o21, inst_o22, inst_o23,
       inst_o24, inst_o25, inst_o26, inst_o27, inst_o28, inst_o29, inst_o30, inst_o31;

  \5_TO_32_DECODER  inst (
    .B4(inst72_out), .B3(D_address_3), .B2(D_address_2), .B1(D_address_1), .B0(D_address_0), .O0(inst_o0),
    .O1(inst_o1), .O2(inst_o2), .O3(inst_o3), .O4(inst_o4), .O5(inst_o5), .O6(inst_o6), .O7(inst_o7),
    .O8(inst_o8), .O9(inst_o9), .O10(inst_o10), .O11(inst_o11), .O12(inst_o12), .O13(inst_o13),
    .O14(inst_o14), .O15(inst_o15), .O16(inst_o16), .O17(inst_o17), .O18(inst_o18), .O19(inst_o19),
    .O20(inst_o20), .O21(inst_o21), .O22(inst_o22), .O23(inst_o23), .O24(inst_o24), .O25(inst_o25),
    .O26(inst_o26), .O27(inst_o27), .O28(inst_o28), .O29(inst_o29), .O30(inst_o30), .O31(inst_o31));
  or inst72 (inst72_out, D_address_4, MLOAD_SWITCH);
  MUL_IN_R1 inst70 (
    .M_INSERT(MUL_RE_INSERT[15:8]), .Rload0(LOAD_0), .Rload1(LOAD_1), .Rload2(LOAD_2), .Rload3(LOAD_3),
    .Rload4(LOAD_4), .Rload5(LOAD_5), .Rload6(LOAD_6), .Rload7(LOAD_7), .Mswitch(MLOAD_SWITCH),
    .OUTPUT0(inst70_output0), .OUTPUT1(inst70_output1), .OUTPUT2(inst70_output2), .OUTPUT3(inst70_output3),
    .OUTPUT4(inst70_output4), .OUTPUT5(inst70_output5), .OUTPUT6(inst70_output6), .OUTPUT7(inst70_output7));
  MUL_IN_R0 inst67 (
    .M_INSERT(MUL_RE_INSERT[7:0]), .Rload0(LOAD_0), .Rload1(LOAD_1), .Rload2(LOAD_2), .Rload3(LOAD_3),
    .Rload4(LOAD_4), .Rload5(LOAD_5), .Rload6(LOAD_6), .Rload7(LOAD_7), .Mswitch(MLOAD_SWITCH),
    .OUTPUT0(inst67_output0), .OUTPUT1(inst67_output1), .OUTPUT2(inst67_output2), .OUTPUT3(inst67_output3),
    .OUTPUT4(inst67_output4), .OUTPUT5(inst67_output5), .OUTPUT6(inst67_output6), .OUTPUT7(inst67_output7));
  \2_1_MUX  inst66 (.I_0(inst_o0), .I_1(1'b1), .Enable(1'b1), .S_0(MLOAD_SWITCH), .OUTPUT(inst66_output));
  \2_1_MUX  inst69 (.I_0(inst_o1), .I_1(1'b1), .Enable(1'b1), .S_0(MLOAD_SWITCH), .OUTPUT(inst69_output));
  Register inst5 (
    .LOAD_0(LOAD_0), .LOAD_1(LOAD_1), .LOAD_2(LOAD_2), .LOAD_3(LOAD_3), .LOAD_4(LOAD_4), .LOAD_5(LOAD_5),
    .LOAD_6(LOAD_6), .LOAD_7(LOAD_7), .W_E(inst_o3), .CLRN(CLRN), .CLOCK(CLOCK), .OUTPUT_0(inst5_output_0),
    .OUTPUT_1(inst5_output_1), .OUTPUT_2(inst5_output_2), .OUTPUT_3(inst5_output_3),
    .OUTPUT_4(inst5_output_4), .OUTPUT_5(inst5_output_5), .OUTPUT_6(inst5_output_6), .OUTPUT_7(inst5_output_7));
  Register inst6 (
    .LOAD_0(LOAD_0), .LOAD_1(LOAD_1), .LOAD_2(LOAD_2), .LOAD_3(LOAD_3), .LOAD_4(LOAD_4), .LOAD_5(LOAD_5),
    .LOAD_6(LOAD_6), .LOAD_7(LOAD_7), .W_E(inst_o4), .CLRN(CLRN), .CLOCK(CLOCK), .OUTPUT_0(inst6_output_0),
    .OUTPUT_1(inst6_output_1), .OUTPUT_2(inst6_output_2), .OUTPUT_3(inst6_output_3),
    .OUTPUT_4(inst6_output_4), .OUTPUT_5(inst6_output_5), .OUTPUT_6(inst6_output_6), .OUTPUT_7(inst6_output_7));
  Register inst7 (
    .LOAD_0(LOAD_0), .LOAD_1(LOAD_1), .LOAD_2(LOAD_2), .LOAD_3(LOAD_3), .LOAD_4(LOAD_4), .LOAD_5(LOAD_5),
    .LOAD_6(LOAD_6), .LOAD_7(LOAD_7), .W_E(inst_o5), .CLRN(CLRN), .CLOCK(CLOCK), .OUTPUT_0(inst7_output_0),
    .OUTPUT_1(inst7_output_1), .OUTPUT_2(inst7_output_2), .OUTPUT_3(inst7_output_3),
    .OUTPUT_4(inst7_output_4), .OUTPUT_5(inst7_output_5), .OUTPUT_6(inst7_output_6), .OUTPUT_7(inst7_output_7));
  Register inst8 (
    .LOAD_0(LOAD_0), .LOAD_1(LOAD_1), .LOAD_2(LOAD_2), .LOAD_3(LOAD_3), .LOAD_4(LOAD_4), .LOAD_5(LOAD_5),
    .LOAD_6(LOAD_6), .LOAD_7(LOAD_7), .W_E(inst_o6), .CLRN(CLRN), .CLOCK(CLOCK), .OUTPUT_0(inst8_output_0),
    .OUTPUT_1(inst8_output_1), .OUTPUT_2(inst8_output_2), .OUTPUT_3(inst8_output_3),
    .OUTPUT_4(inst8_output_4), .OUTPUT_5(inst8_output_5), .OUTPUT_6(inst8_output_6), .OUTPUT_7(inst8_output_7));
  Register inst9 (
    .LOAD_0(LOAD_0), .LOAD_1(LOAD_1), .LOAD_2(LOAD_2), .LOAD_3(LOAD_3), .LOAD_4(LOAD_4), .LOAD_5(LOAD_5),
    .LOAD_6(LOAD_6), .LOAD_7(LOAD_7), .W_E(inst_o7), .CLRN(CLRN), .CLOCK(CLOCK), .OUTPUT_0(inst9_output_0),
    .OUTPUT_1(inst9_output_1), .OUTPUT_2(inst9_output_2), .OUTPUT_3(inst9_output_3),
    .OUTPUT_4(inst9_output_4), .OUTPUT_5(inst9_output_5), .OUTPUT_6(inst9_output_6), .OUTPUT_7(inst9_output_7));
  Register inst10 (
    .LOAD_0(LOAD_0), .LOAD_1(LOAD_1), .LOAD_2(LOAD_2), .LOAD_3(LOAD_3), .LOAD_4(LOAD_4), .LOAD_5(LOAD_5),
    .LOAD_6(LOAD_6), .LOAD_7(LOAD_7), .W_E(inst_o8), .CLRN(CLRN), .CLOCK(CLOCK), .OUTPUT_0(inst10_output_0),
    .OUTPUT_1(inst10_output_1), .OUTPUT_2(inst10_output_2), .OUTPUT_3(inst10_output_3),
    .OUTPUT_4(inst10_output_4), .OUTPUT_5(inst10_output_5), .OUTPUT_6(inst10_output_6),
    .OUTPUT_7(inst10_output_7));
  Register inst11 (
    .LOAD_0(LOAD_0), .LOAD_1(LOAD_1), .LOAD_2(LOAD_2), .LOAD_3(LOAD_3), .LOAD_4(LOAD_4), .LOAD_5(LOAD_5),
    .LOAD_6(LOAD_6), .LOAD_7(LOAD_7), .W_E(inst_o9), .CLRN(CLRN), .CLOCK(CLOCK), .OUTPUT_0(inst11_output_0),
    .OUTPUT_1(inst11_output_1), .OUTPUT_2(inst11_output_2), .OUTPUT_3(inst11_output_3),
    .OUTPUT_4(inst11_output_4), .OUTPUT_5(inst11_output_5), .OUTPUT_6(inst11_output_6),
    .OUTPUT_7(inst11_output_7));
  Register inst12 (
    .LOAD_0(LOAD_0), .LOAD_1(LOAD_1), .LOAD_2(LOAD_2), .LOAD_3(LOAD_3), .LOAD_4(LOAD_4), .LOAD_5(LOAD_5),
    .LOAD_6(LOAD_6), .LOAD_7(LOAD_7), .W_E(inst_o10), .CLRN(CLRN), .CLOCK(CLOCK), .OUTPUT_0(inst12_output_0),
    .OUTPUT_1(inst12_output_1), .OUTPUT_2(inst12_output_2), .OUTPUT_3(inst12_output_3),
    .OUTPUT_4(inst12_output_4), .OUTPUT_5(inst12_output_5), .OUTPUT_6(inst12_output_6),
    .OUTPUT_7(inst12_output_7));
  Register inst13 (
    .LOAD_0(LOAD_0), .LOAD_1(LOAD_1), .LOAD_2(LOAD_2), .LOAD_3(LOAD_3), .LOAD_4(LOAD_4), .LOAD_5(LOAD_5),
    .LOAD_6(LOAD_6), .LOAD_7(LOAD_7), .W_E(inst_o11), .CLRN(CLRN), .CLOCK(CLOCK), .OUTPUT_0(inst13_output_0),
    .OUTPUT_1(inst13_output_1), .OUTPUT_2(inst13_output_2), .OUTPUT_3(inst13_output_3),
    .OUTPUT_4(inst13_output_4), .OUTPUT_5(inst13_output_5), .OUTPUT_6(inst13_output_6),
    .OUTPUT_7(inst13_output_7));
  Register inst14 (
    .LOAD_0(LOAD_0), .LOAD_1(LOAD_1), .LOAD_2(LOAD_2), .LOAD_3(LOAD_3), .LOAD_4(LOAD_4), .LOAD_5(LOAD_5),
    .LOAD_6(LOAD_6), .LOAD_7(LOAD_7), .W_E(inst_o12), .CLRN(CLRN), .CLOCK(CLOCK), .OUTPUT_0(inst14_output_0),
    .OUTPUT_1(inst14_output_1), .OUTPUT_2(inst14_output_2), .OUTPUT_3(inst14_output_3),
    .OUTPUT_4(inst14_output_4), .OUTPUT_5(inst14_output_5), .OUTPUT_6(inst14_output_6),
    .OUTPUT_7(inst14_output_7));
  Register inst15 (
    .LOAD_0(LOAD_0), .LOAD_1(LOAD_1), .LOAD_2(LOAD_2), .LOAD_3(LOAD_3), .LOAD_4(LOAD_4), .LOAD_5(LOAD_5),
    .LOAD_6(LOAD_6), .LOAD_7(LOAD_7), .W_E(inst_o13), .CLRN(CLRN), .CLOCK(CLOCK), .OUTPUT_0(inst15_output_0),
    .OUTPUT_1(inst15_output_1), .OUTPUT_2(inst15_output_2), .OUTPUT_3(inst15_output_3),
    .OUTPUT_4(inst15_output_4), .OUTPUT_5(inst15_output_5), .OUTPUT_6(inst15_output_6),
    .OUTPUT_7(inst15_output_7));
  Register inst16 (
    .LOAD_0(LOAD_0), .LOAD_1(LOAD_1), .LOAD_2(LOAD_2), .LOAD_3(LOAD_3), .LOAD_4(LOAD_4), .LOAD_5(LOAD_5),
    .LOAD_6(LOAD_6), .LOAD_7(LOAD_7), .W_E(inst_o14), .CLRN(CLRN), .CLOCK(CLOCK), .OUTPUT_0(inst16_output_0),
    .OUTPUT_1(inst16_output_1), .OUTPUT_2(inst16_output_2), .OUTPUT_3(inst16_output_3),
    .OUTPUT_4(inst16_output_4), .OUTPUT_5(inst16_output_5), .OUTPUT_6(inst16_output_6),
    .OUTPUT_7(inst16_output_7));
  Register inst17 (
    .LOAD_0(LOAD_0), .LOAD_1(LOAD_1), .LOAD_2(LOAD_2), .LOAD_3(LOAD_3), .LOAD_4(LOAD_4), .LOAD_5(LOAD_5),
    .LOAD_6(LOAD_6), .LOAD_7(LOAD_7), .W_E(inst_o15), .CLRN(CLRN), .CLOCK(CLOCK), .OUTPUT_0(inst17_output_0),
    .OUTPUT_1(inst17_output_1), .OUTPUT_2(inst17_output_2), .OUTPUT_3(inst17_output_3),
    .OUTPUT_4(inst17_output_4), .OUTPUT_5(inst17_output_5), .OUTPUT_6(inst17_output_6),
    .OUTPUT_7(inst17_output_7));
  Register inst18 (
    .LOAD_0(LOAD_0), .LOAD_1(LOAD_1), .LOAD_2(LOAD_2), .LOAD_3(LOAD_3), .LOAD_4(LOAD_4), .LOAD_5(LOAD_5),
    .LOAD_6(LOAD_6), .LOAD_7(LOAD_7), .W_E(inst_o16), .CLRN(CLRN), .CLOCK(CLOCK), .OUTPUT_0(inst18_output_0),
    .OUTPUT_1(inst18_output_1), .OUTPUT_2(inst18_output_2), .OUTPUT_3(inst18_output_3),
    .OUTPUT_4(inst18_output_4), .OUTPUT_5(inst18_output_5), .OUTPUT_6(inst18_output_6),
    .OUTPUT_7(inst18_output_7));
  Register inst19 (
    .LOAD_0(LOAD_0), .LOAD_1(LOAD_1), .LOAD_2(LOAD_2), .LOAD_3(LOAD_3), .LOAD_4(LOAD_4), .LOAD_5(LOAD_5),
    .LOAD_6(LOAD_6), .LOAD_7(LOAD_7), .W_E(inst_o17), .CLRN(CLRN), .CLOCK(CLOCK), .OUTPUT_0(inst19_output_0),
    .OUTPUT_1(inst19_output_1), .OUTPUT_2(inst19_output_2), .OUTPUT_3(inst19_output_3),
    .OUTPUT_4(inst19_output_4), .OUTPUT_5(inst19_output_5), .OUTPUT_6(inst19_output_6),
    .OUTPUT_7(inst19_output_7));
  Register inst20 (
    .LOAD_0(LOAD_0), .LOAD_1(LOAD_1), .LOAD_2(LOAD_2), .LOAD_3(LOAD_3), .LOAD_4(LOAD_4), .LOAD_5(LOAD_5),
    .LOAD_6(LOAD_6), .LOAD_7(LOAD_7), .W_E(inst_o18), .CLRN(CLRN), .CLOCK(CLOCK), .OUTPUT_0(inst20_output_0),
    .OUTPUT_1(inst20_output_1), .OUTPUT_2(inst20_output_2), .OUTPUT_3(inst20_output_3),
    .OUTPUT_4(inst20_output_4), .OUTPUT_5(inst20_output_5), .OUTPUT_6(inst20_output_6),
    .OUTPUT_7(inst20_output_7));
  Register inst21 (
    .LOAD_0(LOAD_0), .LOAD_1(LOAD_1), .LOAD_2(LOAD_2), .LOAD_3(LOAD_3), .LOAD_4(LOAD_4), .LOAD_5(LOAD_5),
    .LOAD_6(LOAD_6), .LOAD_7(LOAD_7), .W_E(inst_o19), .CLRN(CLRN), .CLOCK(CLOCK), .OUTPUT_0(inst21_output_0),
    .OUTPUT_1(inst21_output_1), .OUTPUT_2(inst21_output_2), .OUTPUT_3(inst21_output_3),
    .OUTPUT_4(inst21_output_4), .OUTPUT_5(inst21_output_5), .OUTPUT_6(inst21_output_6),
    .OUTPUT_7(inst21_output_7));
  Register inst22 (
    .LOAD_0(LOAD_0), .LOAD_1(LOAD_1), .LOAD_2(LOAD_2), .LOAD_3(LOAD_3), .LOAD_4(LOAD_4), .LOAD_5(LOAD_5),
    .LOAD_6(LOAD_6), .LOAD_7(LOAD_7), .W_E(inst_o20), .CLRN(CLRN), .CLOCK(CLOCK), .OUTPUT_0(inst22_output_0),
    .OUTPUT_1(inst22_output_1), .OUTPUT_2(inst22_output_2), .OUTPUT_3(inst22_output_3),
    .OUTPUT_4(inst22_output_4), .OUTPUT_5(inst22_output_5), .OUTPUT_6(inst22_output_6),
    .OUTPUT_7(inst22_output_7));
  Register inst23 (
    .LOAD_0(LOAD_0), .LOAD_1(LOAD_1), .LOAD_2(LOAD_2), .LOAD_3(LOAD_3), .LOAD_4(LOAD_4), .LOAD_5(LOAD_5),
    .LOAD_6(LOAD_6), .LOAD_7(LOAD_7), .W_E(inst_o21), .CLRN(CLRN), .CLOCK(CLOCK), .OUTPUT_0(inst23_output_0),
    .OUTPUT_1(inst23_output_1), .OUTPUT_2(inst23_output_2), .OUTPUT_3(inst23_output_3),
    .OUTPUT_4(inst23_output_4), .OUTPUT_5(inst23_output_5), .OUTPUT_6(inst23_output_6),
    .OUTPUT_7(inst23_output_7));
  Register inst24 (
    .LOAD_0(LOAD_0), .LOAD_1(LOAD_1), .LOAD_2(LOAD_2), .LOAD_3(LOAD_3), .LOAD_4(LOAD_4), .LOAD_5(LOAD_5),
    .LOAD_6(LOAD_6), .LOAD_7(LOAD_7), .W_E(inst_o22), .CLRN(CLRN), .CLOCK(CLOCK), .OUTPUT_0(inst24_output_0),
    .OUTPUT_1(inst24_output_1), .OUTPUT_2(inst24_output_2), .OUTPUT_3(inst24_output_3),
    .OUTPUT_4(inst24_output_4), .OUTPUT_5(inst24_output_5), .OUTPUT_6(inst24_output_6),
    .OUTPUT_7(inst24_output_7));
  Register inst25 (
    .LOAD_0(LOAD_0), .LOAD_1(LOAD_1), .LOAD_2(LOAD_2), .LOAD_3(LOAD_3), .LOAD_4(LOAD_4), .LOAD_5(LOAD_5),
    .LOAD_6(LOAD_6), .LOAD_7(LOAD_7), .W_E(inst_o23), .CLRN(CLRN), .CLOCK(CLOCK), .OUTPUT_0(inst25_output_0),
    .OUTPUT_1(inst25_output_1), .OUTPUT_2(inst25_output_2), .OUTPUT_3(inst25_output_3),
    .OUTPUT_4(inst25_output_4), .OUTPUT_5(inst25_output_5), .OUTPUT_6(inst25_output_6),
    .OUTPUT_7(inst25_output_7));
  Register inst26 (
    .LOAD_0(LOAD_0), .LOAD_1(LOAD_1), .LOAD_2(LOAD_2), .LOAD_3(LOAD_3), .LOAD_4(LOAD_4), .LOAD_5(LOAD_5),
    .LOAD_6(LOAD_6), .LOAD_7(LOAD_7), .W_E(inst_o24), .CLRN(CLRN), .CLOCK(CLOCK), .OUTPUT_0(inst26_output_0),
    .OUTPUT_1(inst26_output_1), .OUTPUT_2(inst26_output_2), .OUTPUT_3(inst26_output_3),
    .OUTPUT_4(inst26_output_4), .OUTPUT_5(inst26_output_5), .OUTPUT_6(inst26_output_6),
    .OUTPUT_7(inst26_output_7));
  Register inst27 (
    .LOAD_0(LOAD_0), .LOAD_1(LOAD_1), .LOAD_2(LOAD_2), .LOAD_3(LOAD_3), .LOAD_4(LOAD_4), .LOAD_5(LOAD_5),
    .LOAD_6(LOAD_6), .LOAD_7(LOAD_7), .W_E(inst_o25), .CLRN(CLRN), .CLOCK(CLOCK), .OUTPUT_0(inst27_output_0),
    .OUTPUT_1(inst27_output_1), .OUTPUT_2(inst27_output_2), .OUTPUT_3(inst27_output_3),
    .OUTPUT_4(inst27_output_4), .OUTPUT_5(inst27_output_5), .OUTPUT_6(inst27_output_6),
    .OUTPUT_7(inst27_output_7));
  Register inst28 (
    .LOAD_0(LOAD_0), .LOAD_1(LOAD_1), .LOAD_2(LOAD_2), .LOAD_3(LOAD_3), .LOAD_4(LOAD_4), .LOAD_5(LOAD_5),
    .LOAD_6(LOAD_6), .LOAD_7(LOAD_7), .W_E(inst_o26), .CLRN(CLRN), .CLOCK(CLOCK), .OUTPUT_0(inst28_output_0),
    .OUTPUT_1(inst28_output_1), .OUTPUT_2(inst28_output_2), .OUTPUT_3(inst28_output_3),
    .OUTPUT_4(inst28_output_4), .OUTPUT_5(inst28_output_5), .OUTPUT_6(inst28_output_6),
    .OUTPUT_7(inst28_output_7));
  Register inst29 (
    .LOAD_0(LOAD_0), .LOAD_1(LOAD_1), .LOAD_2(LOAD_2), .LOAD_3(LOAD_3), .LOAD_4(LOAD_4), .LOAD_5(LOAD_5),
    .LOAD_6(LOAD_6), .LOAD_7(LOAD_7), .W_E(inst_o27), .CLRN(CLRN), .CLOCK(CLOCK), .OUTPUT_0(inst29_output_0),
    .OUTPUT_1(inst29_output_1), .OUTPUT_2(inst29_output_2), .OUTPUT_3(inst29_output_3),
    .OUTPUT_4(inst29_output_4), .OUTPUT_5(inst29_output_5), .OUTPUT_6(inst29_output_6),
    .OUTPUT_7(inst29_output_7));
  Register inst30 (
    .LOAD_0(LOAD_0), .LOAD_1(LOAD_1), .LOAD_2(LOAD_2), .LOAD_3(LOAD_3), .LOAD_4(LOAD_4), .LOAD_5(LOAD_5),
    .LOAD_6(LOAD_6), .LOAD_7(LOAD_7), .W_E(inst_o28), .CLRN(CLRN), .CLOCK(CLOCK), .OUTPUT_0(inst30_output_0),
    .OUTPUT_1(inst30_output_1), .OUTPUT_2(inst30_output_2), .OUTPUT_3(inst30_output_3),
    .OUTPUT_4(inst30_output_4), .OUTPUT_5(inst30_output_5), .OUTPUT_6(inst30_output_6),
    .OUTPUT_7(inst30_output_7));
  Register inst31 (
    .LOAD_0(LOAD_0), .LOAD_1(LOAD_1), .LOAD_2(LOAD_2), .LOAD_3(LOAD_3), .LOAD_4(LOAD_4), .LOAD_5(LOAD_5),
    .LOAD_6(LOAD_6), .LOAD_7(LOAD_7), .W_E(inst_o29), .CLRN(CLRN), .CLOCK(CLOCK), .OUTPUT_0(inst31_output_0),
    .OUTPUT_1(inst31_output_1), .OUTPUT_2(inst31_output_2), .OUTPUT_3(inst31_output_3),
    .OUTPUT_4(inst31_output_4), .OUTPUT_5(inst31_output_5), .OUTPUT_6(inst31_output_6),
    .OUTPUT_7(inst31_output_7));
  Register inst32 (
    .LOAD_0(LOAD_0), .LOAD_1(LOAD_1), .LOAD_2(LOAD_2), .LOAD_3(LOAD_3), .LOAD_4(LOAD_4), .LOAD_5(LOAD_5),
    .LOAD_6(LOAD_6), .LOAD_7(LOAD_7), .W_E(inst_o30), .CLRN(CLRN), .CLOCK(CLOCK), .OUTPUT_0(inst32_output_0),
    .OUTPUT_1(inst32_output_1), .OUTPUT_2(inst32_output_2), .OUTPUT_3(inst32_output_3),
    .OUTPUT_4(inst32_output_4), .OUTPUT_5(inst32_output_5), .OUTPUT_6(inst32_output_6),
    .OUTPUT_7(inst32_output_7));
  Register inst33 (
    .LOAD_0(LOAD_0), .LOAD_1(LOAD_1), .LOAD_2(LOAD_2), .LOAD_3(LOAD_3), .LOAD_4(LOAD_4), .LOAD_5(LOAD_5),
    .LOAD_6(LOAD_6), .LOAD_7(LOAD_7), .W_E(inst_o31), .CLRN(CLRN), .CLOCK(CLOCK), .OUTPUT_0(inst33_output_0),
    .OUTPUT_1(inst33_output_1), .OUTPUT_2(inst33_output_2), .OUTPUT_3(inst33_output_3),
    .OUTPUT_4(inst33_output_4), .OUTPUT_5(inst33_output_5), .OUTPUT_6(inst33_output_6),
    .OUTPUT_7(inst33_output_7));
  Register inst2 (
    .LOAD_0(inst67_output0), .LOAD_1(inst67_output1), .LOAD_2(inst67_output2), .LOAD_3(inst67_output3),
    .LOAD_4(inst67_output4), .LOAD_5(inst67_output5), .LOAD_6(inst67_output6), .LOAD_7(inst67_output7),
    .W_E(inst66_output), .CLRN(CLRN), .CLOCK(CLOCK), .OUTPUT_0(inst2_output_0), .OUTPUT_1(inst2_output_1),
    .OUTPUT_2(inst2_output_2), .OUTPUT_3(inst2_output_3), .OUTPUT_4(inst2_output_4),
    .OUTPUT_5(inst2_output_5), .OUTPUT_6(inst2_output_6), .OUTPUT_7(inst2_output_7));
  Register inst3 (
    .LOAD_0(inst70_output0), .LOAD_1(inst70_output1), .LOAD_2(inst70_output2), .LOAD_3(inst70_output3),
    .LOAD_4(inst70_output4), .LOAD_5(inst70_output5), .LOAD_6(inst70_output6), .LOAD_7(inst70_output7),
    .W_E(inst69_output), .CLRN(CLRN), .CLOCK(CLOCK), .OUTPUT_0(inst3_output_0), .OUTPUT_1(inst3_output_1),
    .OUTPUT_2(inst3_output_2), .OUTPUT_3(inst3_output_3), .OUTPUT_4(inst3_output_4),
    .OUTPUT_5(inst3_output_5), .OUTPUT_6(inst3_output_6), .OUTPUT_7(inst3_output_7));
  Register inst4 (
    .LOAD_0(LOAD_0), .LOAD_1(LOAD_1), .LOAD_2(LOAD_2), .LOAD_3(LOAD_3), .LOAD_4(LOAD_4), .LOAD_5(LOAD_5),
    .LOAD_6(LOAD_6), .LOAD_7(LOAD_7), .W_E(inst_o2), .CLRN(CLRN), .CLOCK(CLOCK), .OUTPUT_0(inst4_output_0),
    .OUTPUT_1(inst4_output_1), .OUTPUT_2(inst4_output_2), .OUTPUT_3(inst4_output_3),
    .OUTPUT_4(inst4_output_4), .OUTPUT_5(inst4_output_5), .OUTPUT_6(inst4_output_6), .OUTPUT_7(inst4_output_7));
  \32_1_MUX  inst41 (
    .MXU_0(inst2_output_7), .MXU_1(inst3_output_7), .MXU_2(inst4_output_7), .MXU_3(inst5_output_7),
    .MXU_4(inst6_output_7), .MXU_5(inst7_output_7), .MXU_6(inst8_output_7), .MXU_7(inst9_output_7),
    .MXU_8(inst10_output_7), .MXU_9(inst11_output_7), .MXU_10(inst12_output_7), .MXU_11(inst13_output_7),
    .MXU_12(inst14_output_7), .MXU_13(inst15_output_7), .MXU_14(inst16_output_7), .MXU_15(inst17_output_7),
    .MXU_16(inst18_output_7), .MXU_17(inst19_output_7), .MXU_18(inst20_output_7), .MXU_19(inst21_output_7),
    .MXU_20(inst22_output_7), .MXU_21(inst23_output_7), .MXU_22(inst24_output_7), .MXU_23(inst25_output_7),
    .MXU_24(inst26_output_7), .MXU_25(inst27_output_7), .MXU_26(inst28_output_7), .MXU_27(inst29_output_7),
    .MXU_28(inst30_output_7), .MXU_29(inst31_output_7), .MXU_30(inst32_output_7), .MXU_31(inst33_output_7),
    .S4(inst72_out), .S3(D_address_3), .S2(D_address_2), .S1(D_address_1), .S0(D_address_0), .ENABLE(ENABLE),
    .OUTPUT(D_READ_7));
  \32_1_MUX  inst34 (
    .MXU_0(inst2_output_7), .MXU_1(inst3_output_7), .MXU_2(inst4_output_7), .MXU_3(inst5_output_7),
    .MXU_4(inst6_output_7), .MXU_5(inst7_output_7), .MXU_6(inst8_output_7), .MXU_7(inst9_output_7),
    .MXU_8(inst10_output_7), .MXU_9(inst11_output_7), .MXU_10(inst12_output_7), .MXU_11(inst13_output_7),
    .MXU_12(inst14_output_7), .MXU_13(inst15_output_7), .MXU_14(inst16_output_7), .MXU_15(inst17_output_7),
    .MXU_16(inst18_output_7), .MXU_17(inst19_output_7), .MXU_18(inst20_output_7), .MXU_19(inst21_output_7),
    .MXU_20(inst22_output_7), .MXU_21(inst23_output_7), .MXU_22(inst24_output_7), .MXU_23(inst25_output_7),
    .MXU_24(inst26_output_7), .MXU_25(inst27_output_7), .MXU_26(inst28_output_7), .MXU_27(inst29_output_7),
    .MXU_28(inst30_output_7), .MXU_29(inst31_output_7), .MXU_30(inst32_output_7), .MXU_31(inst33_output_7),
    .S4(R_address_4), .S3(R_address_3), .S2(R_address_2), .S1(R_address_1), .S0(R_address_0),
    .ENABLE(ENABLE), .OUTPUT(R_READ_7));
  \32_1_MUX  inst42 (
    .MXU_0(inst2_output_6), .MXU_1(inst3_output_6), .MXU_2(inst4_output_6), .MXU_3(inst5_output_6),
    .MXU_4(inst6_output_6), .MXU_5(inst7_output_6), .MXU_6(inst8_output_6), .MXU_7(inst9_output_6),
    .MXU_8(inst10_output_6), .MXU_9(inst11_output_6), .MXU_10(inst12_output_6), .MXU_11(inst13_output_6),
    .MXU_12(inst14_output_6), .MXU_13(inst15_output_6), .MXU_14(inst16_output_6), .MXU_15(inst17_output_6),
    .MXU_16(inst18_output_6), .MXU_17(inst19_output_6), .MXU_18(inst20_output_6), .MXU_19(inst21_output_6),
    .MXU_20(inst22_output_6), .MXU_21(inst23_output_6), .MXU_22(inst24_output_6), .MXU_23(inst25_output_6),
    .MXU_24(inst26_output_6), .MXU_25(inst27_output_6), .MXU_26(inst28_output_6), .MXU_27(inst29_output_6),
    .MXU_28(inst30_output_6), .MXU_29(inst31_output_6), .MXU_30(inst32_output_6), .MXU_31(inst33_output_6),
    .S4(inst72_out), .S3(D_address_3), .S2(D_address_2), .S1(D_address_1), .S0(D_address_0), .ENABLE(ENABLE),
    .OUTPUT(D_READ_6));
  \32_1_MUX  inst49 (
    .MXU_0(inst2_output_6), .MXU_1(inst3_output_6), .MXU_2(inst4_output_6), .MXU_3(inst5_output_6),
    .MXU_4(inst6_output_6), .MXU_5(inst7_output_6), .MXU_6(inst8_output_6), .MXU_7(inst9_output_6),
    .MXU_8(inst10_output_6), .MXU_9(inst11_output_6), .MXU_10(inst12_output_6), .MXU_11(inst13_output_6),
    .MXU_12(inst14_output_6), .MXU_13(inst15_output_6), .MXU_14(inst16_output_6), .MXU_15(inst17_output_6),
    .MXU_16(inst18_output_6), .MXU_17(inst19_output_6), .MXU_18(inst20_output_6), .MXU_19(inst21_output_6),
    .MXU_20(inst22_output_6), .MXU_21(inst23_output_6), .MXU_22(inst24_output_6), .MXU_23(inst25_output_6),
    .MXU_24(inst26_output_6), .MXU_25(inst27_output_6), .MXU_26(inst28_output_6), .MXU_27(inst29_output_6),
    .MXU_28(inst30_output_6), .MXU_29(inst31_output_6), .MXU_30(inst32_output_6), .MXU_31(inst33_output_6),
    .S4(R_address_4), .S3(R_address_3), .S2(R_address_2), .S1(R_address_1), .S0(R_address_0),
    .ENABLE(ENABLE), .OUTPUT(R_READ_6));
  \32_1_MUX  inst43 (
    .MXU_0(inst2_output_5), .MXU_1(inst3_output_5), .MXU_2(inst4_output_5), .MXU_3(inst5_output_5),
    .MXU_4(inst6_output_5), .MXU_5(inst7_output_5), .MXU_6(inst8_output_5), .MXU_7(inst9_output_5),
    .MXU_8(inst10_output_5), .MXU_9(inst11_output_5), .MXU_10(inst12_output_5), .MXU_11(inst13_output_5),
    .MXU_12(inst14_output_5), .MXU_13(inst15_output_5), .MXU_14(inst16_output_5), .MXU_15(inst17_output_5),
    .MXU_16(inst18_output_5), .MXU_17(inst19_output_5), .MXU_18(inst20_output_5), .MXU_19(inst21_output_5),
    .MXU_20(inst22_output_5), .MXU_21(inst23_output_5), .MXU_22(inst24_output_5), .MXU_23(inst25_output_5),
    .MXU_24(inst26_output_5), .MXU_25(inst27_output_5), .MXU_26(inst28_output_5), .MXU_27(inst29_output_5),
    .MXU_28(inst30_output_5), .MXU_29(inst31_output_5), .MXU_30(inst32_output_5), .MXU_31(inst33_output_5),
    .S4(inst72_out), .S3(D_address_3), .S2(D_address_2), .S1(D_address_1), .S0(D_address_0), .ENABLE(ENABLE),
    .OUTPUT(D_READ_5));
  \32_1_MUX  inst36 (
    .MXU_0(inst2_output_5), .MXU_1(inst3_output_5), .MXU_2(inst4_output_5), .MXU_3(inst5_output_5),
    .MXU_4(inst6_output_5), .MXU_5(inst7_output_5), .MXU_6(inst8_output_5), .MXU_7(inst9_output_5),
    .MXU_8(inst10_output_5), .MXU_9(inst11_output_5), .MXU_10(inst12_output_5), .MXU_11(inst13_output_5),
    .MXU_12(inst14_output_5), .MXU_13(inst15_output_5), .MXU_14(inst16_output_5), .MXU_15(inst17_output_5),
    .MXU_16(inst18_output_5), .MXU_17(inst19_output_5), .MXU_18(inst20_output_5), .MXU_19(inst21_output_5),
    .MXU_20(inst22_output_5), .MXU_21(inst23_output_5), .MXU_22(inst24_output_5), .MXU_23(inst25_output_5),
    .MXU_24(inst26_output_5), .MXU_25(inst27_output_5), .MXU_26(inst28_output_5), .MXU_27(inst29_output_5),
    .MXU_28(inst30_output_5), .MXU_29(inst31_output_5), .MXU_30(inst32_output_5), .MXU_31(inst33_output_5),
    .S4(R_address_4), .S3(R_address_3), .S2(R_address_2), .S1(R_address_1), .S0(R_address_0),
    .ENABLE(ENABLE), .OUTPUT(R_READ_5));
  \32_1_MUX  inst44 (
    .MXU_0(inst2_output_4), .MXU_1(inst3_output_4), .MXU_2(inst4_output_4), .MXU_3(inst5_output_4),
    .MXU_4(inst6_output_4), .MXU_5(inst7_output_4), .MXU_6(inst8_output_4), .MXU_7(inst9_output_4),
    .MXU_8(inst10_output_4), .MXU_9(inst11_output_4), .MXU_10(inst12_output_4), .MXU_11(inst13_output_4),
    .MXU_12(inst14_output_4), .MXU_13(inst15_output_4), .MXU_14(inst16_output_4), .MXU_15(inst17_output_4),
    .MXU_16(inst18_output_4), .MXU_17(inst19_output_4), .MXU_18(inst20_output_4), .MXU_19(inst21_output_4),
    .MXU_20(inst22_output_4), .MXU_21(inst23_output_4), .MXU_22(inst24_output_4), .MXU_23(inst25_output_4),
    .MXU_24(inst26_output_4), .MXU_25(inst27_output_4), .MXU_26(inst28_output_4), .MXU_27(inst29_output_4),
    .MXU_28(inst30_output_4), .MXU_29(inst31_output_4), .MXU_30(inst32_output_4), .MXU_31(inst33_output_4),
    .S4(inst72_out), .S3(D_address_3), .S2(D_address_2), .S1(D_address_1), .S0(D_address_0), .ENABLE(ENABLE),
    .OUTPUT(D_READ_4));
  \32_1_MUX  inst35 (
    .MXU_0(inst2_output_4), .MXU_1(inst3_output_4), .MXU_2(inst4_output_4), .MXU_3(inst5_output_4),
    .MXU_4(inst6_output_4), .MXU_5(inst7_output_4), .MXU_6(inst8_output_4), .MXU_7(inst9_output_4),
    .MXU_8(inst10_output_4), .MXU_9(inst11_output_4), .MXU_10(inst12_output_4), .MXU_11(inst13_output_4),
    .MXU_12(inst14_output_4), .MXU_13(inst15_output_4), .MXU_14(inst16_output_4), .MXU_15(inst17_output_4),
    .MXU_16(inst18_output_4), .MXU_17(inst19_output_4), .MXU_18(inst20_output_4), .MXU_19(inst21_output_4),
    .MXU_20(inst22_output_4), .MXU_21(inst23_output_4), .MXU_22(inst24_output_4), .MXU_23(inst25_output_4),
    .MXU_24(inst26_output_4), .MXU_25(inst27_output_4), .MXU_26(inst28_output_4), .MXU_27(inst29_output_4),
    .MXU_28(inst30_output_4), .MXU_29(inst31_output_4), .MXU_30(inst32_output_4), .MXU_31(inst33_output_4),
    .S4(R_address_4), .S3(R_address_3), .S2(R_address_2), .S1(R_address_1), .S0(R_address_0),
    .ENABLE(ENABLE), .OUTPUT(R_READ_4));
  \32_1_MUX  inst45 (
    .MXU_0(inst2_output_3), .MXU_1(inst3_output_3), .MXU_2(inst4_output_3), .MXU_3(inst5_output_3),
    .MXU_4(inst6_output_3), .MXU_5(inst7_output_3), .MXU_6(inst8_output_3), .MXU_7(inst9_output_3),
    .MXU_8(inst10_output_3), .MXU_9(inst11_output_3), .MXU_10(inst12_output_3), .MXU_11(inst13_output_3),
    .MXU_12(inst14_output_3), .MXU_13(inst15_output_3), .MXU_14(inst16_output_3), .MXU_15(inst17_output_3),
    .MXU_16(inst18_output_3), .MXU_17(inst19_output_3), .MXU_18(inst20_output_3), .MXU_19(inst21_output_3),
    .MXU_20(inst22_output_3), .MXU_21(inst23_output_3), .MXU_22(inst24_output_3), .MXU_23(inst25_output_3),
    .MXU_24(inst26_output_3), .MXU_25(inst27_output_3), .MXU_26(inst28_output_3), .MXU_27(inst29_output_3),
    .MXU_28(inst30_output_3), .MXU_29(inst31_output_3), .MXU_30(inst32_output_3), .MXU_31(inst33_output_3),
    .S4(inst72_out), .S3(D_address_3), .S2(D_address_2), .S1(D_address_1), .S0(D_address_0), .ENABLE(ENABLE),
    .OUTPUT(D_READ_3));
  \32_1_MUX  inst38 (
    .MXU_0(inst2_output_3), .MXU_1(inst3_output_3), .MXU_2(inst4_output_3), .MXU_3(inst5_output_3),
    .MXU_4(inst6_output_3), .MXU_5(inst7_output_3), .MXU_6(inst8_output_3), .MXU_7(inst9_output_3),
    .MXU_8(inst10_output_3), .MXU_9(inst11_output_3), .MXU_10(inst12_output_3), .MXU_11(inst13_output_3),
    .MXU_12(inst14_output_3), .MXU_13(inst15_output_3), .MXU_14(inst16_output_3), .MXU_15(inst17_output_3),
    .MXU_16(inst18_output_3), .MXU_17(inst19_output_3), .MXU_18(inst20_output_3), .MXU_19(inst21_output_3),
    .MXU_20(inst22_output_3), .MXU_21(inst23_output_3), .MXU_22(inst24_output_3), .MXU_23(inst25_output_3),
    .MXU_24(inst26_output_3), .MXU_25(inst27_output_3), .MXU_26(inst28_output_3), .MXU_27(inst29_output_3),
    .MXU_28(inst30_output_3), .MXU_29(inst31_output_3), .MXU_30(inst32_output_3), .MXU_31(inst33_output_3),
    .S4(R_address_4), .S3(R_address_3), .S2(R_address_2), .S1(R_address_1), .S0(R_address_0),
    .ENABLE(ENABLE), .OUTPUT(R_READ_3));
  \32_1_MUX  inst46 (
    .MXU_0(inst2_output_2), .MXU_1(inst3_output_2), .MXU_2(inst4_output_2), .MXU_3(inst5_output_2),
    .MXU_4(inst6_output_2), .MXU_5(inst7_output_2), .MXU_6(inst8_output_2), .MXU_7(inst9_output_2),
    .MXU_8(inst10_output_2), .MXU_9(inst11_output_2), .MXU_10(inst12_output_2), .MXU_11(inst13_output_2),
    .MXU_12(inst14_output_2), .MXU_13(inst15_output_2), .MXU_14(inst16_output_2), .MXU_15(inst17_output_2),
    .MXU_16(inst18_output_2), .MXU_17(inst19_output_2), .MXU_18(inst20_output_2), .MXU_19(inst21_output_2),
    .MXU_20(inst22_output_2), .MXU_21(inst23_output_2), .MXU_22(inst24_output_2), .MXU_23(inst25_output_2),
    .MXU_24(inst26_output_2), .MXU_25(inst27_output_2), .MXU_26(inst28_output_2), .MXU_27(inst29_output_2),
    .MXU_28(inst30_output_2), .MXU_29(inst31_output_2), .MXU_30(inst32_output_2), .MXU_31(inst33_output_2),
    .S4(inst72_out), .S3(D_address_3), .S2(D_address_2), .S1(D_address_1), .S0(D_address_0), .ENABLE(ENABLE),
    .OUTPUT(D_READ_2));
  \32_1_MUX  inst37 (
    .MXU_0(inst2_output_2), .MXU_1(inst3_output_2), .MXU_2(inst4_output_2), .MXU_3(inst5_output_2),
    .MXU_4(inst6_output_2), .MXU_5(inst7_output_2), .MXU_6(inst8_output_2), .MXU_7(inst9_output_2),
    .MXU_8(inst10_output_2), .MXU_9(inst11_output_2), .MXU_10(inst12_output_2), .MXU_11(inst13_output_2),
    .MXU_12(inst14_output_2), .MXU_13(inst15_output_2), .MXU_14(inst16_output_2), .MXU_15(inst17_output_2),
    .MXU_16(inst18_output_2), .MXU_17(inst19_output_2), .MXU_18(inst20_output_2), .MXU_19(inst21_output_2),
    .MXU_20(inst22_output_2), .MXU_21(inst23_output_2), .MXU_22(inst24_output_2), .MXU_23(inst25_output_2),
    .MXU_24(inst26_output_2), .MXU_25(inst27_output_2), .MXU_26(inst28_output_2), .MXU_27(inst29_output_2),
    .MXU_28(inst30_output_2), .MXU_29(inst31_output_2), .MXU_30(inst32_output_2), .MXU_31(inst33_output_2),
    .S4(R_address_4), .S3(R_address_3), .S2(R_address_2), .S1(R_address_1), .S0(R_address_0),
    .ENABLE(ENABLE), .OUTPUT(R_READ_2));
  \32_1_MUX  inst47 (
    .MXU_0(inst2_output_1), .MXU_1(inst3_output_1), .MXU_2(inst4_output_1), .MXU_3(inst5_output_1),
    .MXU_4(inst6_output_1), .MXU_5(inst7_output_1), .MXU_6(inst8_output_1), .MXU_7(inst9_output_1),
    .MXU_8(inst10_output_1), .MXU_9(inst11_output_1), .MXU_10(inst12_output_1), .MXU_11(inst13_output_1),
    .MXU_12(inst14_output_1), .MXU_13(inst15_output_1), .MXU_14(inst16_output_1), .MXU_15(inst17_output_1),
    .MXU_16(inst18_output_1), .MXU_17(inst19_output_1), .MXU_18(inst20_output_1), .MXU_19(inst21_output_1),
    .MXU_20(inst22_output_1), .MXU_21(inst23_output_1), .MXU_22(inst24_output_1), .MXU_23(inst25_output_1),
    .MXU_24(inst26_output_1), .MXU_25(inst27_output_1), .MXU_26(inst28_output_1), .MXU_27(inst29_output_1),
    .MXU_28(inst30_output_1), .MXU_29(inst31_output_1), .MXU_30(inst32_output_1), .MXU_31(inst33_output_1),
    .S4(inst72_out), .S3(D_address_3), .S2(D_address_2), .S1(D_address_1), .S0(D_address_0), .ENABLE(ENABLE),
    .OUTPUT(D_READ_1));
  \32_1_MUX  inst40 (
    .MXU_0(inst2_output_1), .MXU_1(inst3_output_1), .MXU_2(inst4_output_1), .MXU_3(inst5_output_1),
    .MXU_4(inst6_output_1), .MXU_5(inst7_output_1), .MXU_6(inst8_output_1), .MXU_7(inst9_output_1),
    .MXU_8(inst10_output_1), .MXU_9(inst11_output_1), .MXU_10(inst12_output_1), .MXU_11(inst13_output_1),
    .MXU_12(inst14_output_1), .MXU_13(inst15_output_1), .MXU_14(inst16_output_1), .MXU_15(inst17_output_1),
    .MXU_16(inst18_output_1), .MXU_17(inst19_output_1), .MXU_18(inst20_output_1), .MXU_19(inst21_output_1),
    .MXU_20(inst22_output_1), .MXU_21(inst23_output_1), .MXU_22(inst24_output_1), .MXU_23(inst25_output_1),
    .MXU_24(inst26_output_1), .MXU_25(inst27_output_1), .MXU_26(inst28_output_1), .MXU_27(inst29_output_1),
    .MXU_28(inst30_output_1), .MXU_29(inst31_output_1), .MXU_30(inst32_output_1), .MXU_31(inst33_output_1),
    .S4(R_address_4), .S3(R_address_3), .S2(R_address_2), .S1(R_address_1), .S0(R_address_0),
    .ENABLE(ENABLE), .OUTPUT(R_READ_1));
  \32_1_MUX  inst48 (
    .MXU_0(inst2_output_0), .MXU_1(inst3_output_0), .MXU_2(inst4_output_0), .MXU_3(inst5_output_0),
    .MXU_4(inst6_output_0), .MXU_5(inst7_output_0), .MXU_6(inst8_output_0), .MXU_7(inst9_output_0),
    .MXU_8(inst10_output_0), .MXU_9(inst11_output_0), .MXU_10(inst12_output_0), .MXU_11(inst13_output_0),
    .MXU_12(inst14_output_0), .MXU_13(inst15_output_0), .MXU_14(inst16_output_0), .MXU_15(inst17_output_0),
    .MXU_16(inst18_output_0), .MXU_17(inst19_output_0), .MXU_18(inst20_output_0), .MXU_19(inst21_output_0),
    .MXU_20(inst22_output_0), .MXU_21(inst23_output_0), .MXU_22(inst24_output_0), .MXU_23(inst25_output_0),
    .MXU_24(inst26_output_0), .MXU_25(inst27_output_0), .MXU_26(inst28_output_0), .MXU_27(inst29_output_0),
    .MXU_28(inst30_output_0), .MXU_29(inst31_output_0), .MXU_30(inst32_output_0), .MXU_31(inst33_output_0),
    .S4(inst72_out), .S3(D_address_3), .S2(D_address_2), .S1(D_address_1), .S0(D_address_0), .ENABLE(ENABLE),
    .OUTPUT(D_READ_0));
  \32_1_MUX  inst39 (
    .MXU_0(inst2_output_0), .MXU_1(inst3_output_0), .MXU_2(inst4_output_0), .MXU_3(inst5_output_0),
    .MXU_4(inst6_output_0), .MXU_5(inst7_output_0), .MXU_6(inst8_output_0), .MXU_7(inst9_output_0),
    .MXU_8(inst10_output_0), .MXU_9(inst11_output_0), .MXU_10(inst12_output_0), .MXU_11(inst13_output_0),
    .MXU_12(inst14_output_0), .MXU_13(inst15_output_0), .MXU_14(inst16_output_0), .MXU_15(inst17_output_0),
    .MXU_16(inst18_output_0), .MXU_17(inst19_output_0), .MXU_18(inst20_output_0), .MXU_19(inst21_output_0),
    .MXU_20(inst22_output_0), .MXU_21(inst23_output_0), .MXU_22(inst24_output_0), .MXU_23(inst25_output_0),
    .MXU_24(inst26_output_0), .MXU_25(inst27_output_0), .MXU_26(inst28_output_0), .MXU_27(inst29_output_0),
    .MXU_28(inst30_output_0), .MXU_29(inst31_output_0), .MXU_30(inst32_output_0), .MXU_31(inst33_output_0),
    .S4(R_address_4), .S3(R_address_3), .S2(R_address_2), .S1(R_address_1), .S0(R_address_0),
    .ENABLE(ENABLE), .OUTPUT(R_READ_0));
  \32_1_MUX  inst1 (
    .MXU_0(inst2_output_0), .MXU_1(inst3_output_0), .MXU_2(inst4_output_0), .MXU_3(inst5_output_0),
    .MXU_4(inst6_output_0), .MXU_5(inst7_output_0), .MXU_6(inst8_output_0), .MXU_7(inst9_output_0),
    .MXU_8(inst10_output_0), .MXU_9(inst11_output_0), .MXU_10(inst12_output_0), .MXU_11(inst13_output_0),
    .MXU_12(inst14_output_0), .MXU_13(inst15_output_0), .MXU_14(inst16_output_0), .MXU_15(inst17_output_0),
    .MXU_16(inst18_output_0), .MXU_17(inst19_output_0), .MXU_18(inst20_output_0), .MXU_19(inst21_output_0),
    .MXU_20(inst22_output_0), .MXU_21(inst23_output_0), .MXU_22(inst24_output_0), .MXU_23(inst25_output_0),
    .MXU_24(inst26_output_0), .MXU_25(inst27_output_0), .MXU_26(inst28_output_0), .MXU_27(inst29_output_0),
    .MXU_28(inst30_output_0), .MXU_29(inst31_output_0), .MXU_30(inst32_output_0), .MXU_31(inst33_output_0),
    .S4(DISP9), .S3(DISP8), .S2(DISP7), .S1(DISP6), .S0(DISP5), .ENABLE(1'b1), .OUTPUT(Db8));
  \32_1_MUX  inst50 (
    .MXU_0(inst2_output_1), .MXU_1(inst3_output_1), .MXU_2(inst4_output_1), .MXU_3(inst5_output_1),
    .MXU_4(inst6_output_1), .MXU_5(inst7_output_1), .MXU_6(inst8_output_1), .MXU_7(inst9_output_1),
    .MXU_8(inst10_output_1), .MXU_9(inst11_output_1), .MXU_10(inst12_output_1), .MXU_11(inst13_output_1),
    .MXU_12(inst14_output_1), .MXU_13(inst15_output_1), .MXU_14(inst16_output_1), .MXU_15(inst17_output_1),
    .MXU_16(inst18_output_1), .MXU_17(inst19_output_1), .MXU_18(inst20_output_1), .MXU_19(inst21_output_1),
    .MXU_20(inst22_output_1), .MXU_21(inst23_output_1), .MXU_22(inst24_output_1), .MXU_23(inst25_output_1),
    .MXU_24(inst26_output_1), .MXU_25(inst27_output_1), .MXU_26(inst28_output_1), .MXU_27(inst29_output_1),
    .MXU_28(inst30_output_1), .MXU_29(inst31_output_1), .MXU_30(inst32_output_1), .MXU_31(inst33_output_1),
    .S4(DISP9), .S3(DISP8), .S2(DISP7), .S1(DISP6), .S0(DISP5), .ENABLE(1'b1), .OUTPUT(Db9));
  \32_1_MUX  inst51 (
    .MXU_0(inst2_output_2), .MXU_1(inst3_output_2), .MXU_2(inst4_output_2), .MXU_3(inst5_output_2),
    .MXU_4(inst6_output_2), .MXU_5(inst7_output_2), .MXU_6(inst8_output_2), .MXU_7(inst9_output_2),
    .MXU_8(inst10_output_2), .MXU_9(inst11_output_2), .MXU_10(inst12_output_2), .MXU_11(inst13_output_2),
    .MXU_12(inst14_output_2), .MXU_13(inst15_output_2), .MXU_14(inst16_output_2), .MXU_15(inst17_output_2),
    .MXU_16(inst18_output_2), .MXU_17(inst19_output_2), .MXU_18(inst20_output_2), .MXU_19(inst21_output_2),
    .MXU_20(inst22_output_2), .MXU_21(inst23_output_2), .MXU_22(inst24_output_2), .MXU_23(inst25_output_2),
    .MXU_24(inst26_output_2), .MXU_25(inst27_output_2), .MXU_26(inst28_output_2), .MXU_27(inst29_output_2),
    .MXU_28(inst30_output_2), .MXU_29(inst31_output_2), .MXU_30(inst32_output_2), .MXU_31(inst33_output_2),
    .S4(DISP9), .S3(DISP8), .S2(DISP7), .S1(DISP6), .S0(DISP5), .ENABLE(1'b1), .OUTPUT(Db10));
  \32_1_MUX  inst52 (
    .MXU_0(inst2_output_3), .MXU_1(inst3_output_3), .MXU_2(inst4_output_3), .MXU_3(inst5_output_3),
    .MXU_4(inst6_output_3), .MXU_5(inst7_output_3), .MXU_6(inst8_output_3), .MXU_7(inst9_output_3),
    .MXU_8(inst10_output_3), .MXU_9(inst11_output_3), .MXU_10(inst12_output_3), .MXU_11(inst13_output_3),
    .MXU_12(inst14_output_3), .MXU_13(inst15_output_3), .MXU_14(inst16_output_3), .MXU_15(inst17_output_3),
    .MXU_16(inst18_output_3), .MXU_17(inst19_output_3), .MXU_18(inst20_output_3), .MXU_19(inst21_output_3),
    .MXU_20(inst22_output_3), .MXU_21(inst23_output_3), .MXU_22(inst24_output_3), .MXU_23(inst25_output_3),
    .MXU_24(inst26_output_3), .MXU_25(inst27_output_3), .MXU_26(inst28_output_3), .MXU_27(inst29_output_3),
    .MXU_28(inst30_output_3), .MXU_29(inst31_output_3), .MXU_30(inst32_output_3), .MXU_31(inst33_output_3),
    .S4(DISP9), .S3(DISP8), .S2(DISP7), .S1(DISP6), .S0(DISP5), .ENABLE(1'b1), .OUTPUT(Db11));
  \32_1_MUX  inst53 (
    .MXU_0(inst2_output_4), .MXU_1(inst3_output_4), .MXU_2(inst4_output_4), .MXU_3(inst5_output_4),
    .MXU_4(inst6_output_4), .MXU_5(inst7_output_4), .MXU_6(inst8_output_4), .MXU_7(inst9_output_4),
    .MXU_8(inst10_output_4), .MXU_9(inst11_output_4), .MXU_10(inst12_output_4), .MXU_11(inst13_output_4),
    .MXU_12(inst14_output_4), .MXU_13(inst15_output_4), .MXU_14(inst16_output_4), .MXU_15(inst17_output_4),
    .MXU_16(inst18_output_4), .MXU_17(inst19_output_4), .MXU_18(inst20_output_4), .MXU_19(inst21_output_4),
    .MXU_20(inst22_output_4), .MXU_21(inst23_output_4), .MXU_22(inst24_output_4), .MXU_23(inst25_output_4),
    .MXU_24(inst26_output_4), .MXU_25(inst27_output_4), .MXU_26(inst28_output_4), .MXU_27(inst29_output_4),
    .MXU_28(inst30_output_4), .MXU_29(inst31_output_4), .MXU_30(inst32_output_4), .MXU_31(inst33_output_4),
    .S4(DISP9), .S3(DISP8), .S2(DISP7), .S1(DISP6), .S0(DISP5), .ENABLE(1'b1), .OUTPUT(Db12));
  \32_1_MUX  inst54 (
    .MXU_0(inst2_output_5), .MXU_1(inst3_output_5), .MXU_2(inst4_output_5), .MXU_3(inst5_output_5),
    .MXU_4(inst6_output_5), .MXU_5(inst7_output_5), .MXU_6(inst8_output_5), .MXU_7(inst9_output_5),
    .MXU_8(inst10_output_5), .MXU_9(inst11_output_5), .MXU_10(inst12_output_5), .MXU_11(inst13_output_5),
    .MXU_12(inst14_output_5), .MXU_13(inst15_output_5), .MXU_14(inst16_output_5), .MXU_15(inst17_output_5),
    .MXU_16(inst18_output_5), .MXU_17(inst19_output_5), .MXU_18(inst20_output_5), .MXU_19(inst21_output_5),
    .MXU_20(inst22_output_5), .MXU_21(inst23_output_5), .MXU_22(inst24_output_5), .MXU_23(inst25_output_5),
    .MXU_24(inst26_output_5), .MXU_25(inst27_output_5), .MXU_26(inst28_output_5), .MXU_27(inst29_output_5),
    .MXU_28(inst30_output_5), .MXU_29(inst31_output_5), .MXU_30(inst32_output_5), .MXU_31(inst33_output_5),
    .S4(DISP9), .S3(DISP8), .S2(DISP7), .S1(DISP6), .S0(DISP5), .ENABLE(1'b1), .OUTPUT(Db13));
  \32_1_MUX  inst55 (
    .MXU_0(inst2_output_6), .MXU_1(inst3_output_6), .MXU_2(inst4_output_6), .MXU_3(inst5_output_6),
    .MXU_4(inst6_output_6), .MXU_5(inst7_output_6), .MXU_6(inst8_output_6), .MXU_7(inst9_output_6),
    .MXU_8(inst10_output_6), .MXU_9(inst11_output_6), .MXU_10(inst12_output_6), .MXU_11(inst13_output_6),
    .MXU_12(inst14_output_6), .MXU_13(inst15_output_6), .MXU_14(inst16_output_6), .MXU_15(inst17_output_6),
    .MXU_16(inst18_output_6), .MXU_17(inst19_output_6), .MXU_18(inst20_output_6), .MXU_19(inst21_output_6),
    .MXU_20(inst22_output_6), .MXU_21(inst23_output_6), .MXU_22(inst24_output_6), .MXU_23(inst25_output_6),
    .MXU_24(inst26_output_6), .MXU_25(inst27_output_6), .MXU_26(inst28_output_6), .MXU_27(inst29_output_6),
    .MXU_28(inst30_output_6), .MXU_29(inst31_output_6), .MXU_30(inst32_output_6), .MXU_31(inst33_output_6),
    .S4(DISP9), .S3(DISP8), .S2(DISP7), .S1(DISP6), .S0(DISP5), .ENABLE(1'b1), .OUTPUT(Db14));
  \32_1_MUX  inst56 (
    .MXU_0(inst2_output_7), .MXU_1(inst3_output_7), .MXU_2(inst4_output_7), .MXU_3(inst5_output_7),
    .MXU_4(inst6_output_7), .MXU_5(inst7_output_7), .MXU_6(inst8_output_7), .MXU_7(inst9_output_7),
    .MXU_8(inst10_output_7), .MXU_9(inst11_output_7), .MXU_10(inst12_output_7), .MXU_11(inst13_output_7),
    .MXU_12(inst14_output_7), .MXU_13(inst15_output_7), .MXU_14(inst16_output_7), .MXU_15(inst17_output_7),
    .MXU_16(inst18_output_7), .MXU_17(inst19_output_7), .MXU_18(inst20_output_7), .MXU_19(inst21_output_7),
    .MXU_20(inst22_output_7), .MXU_21(inst23_output_7), .MXU_22(inst24_output_7), .MXU_23(inst25_output_7),
    .MXU_24(inst26_output_7), .MXU_25(inst27_output_7), .MXU_26(inst28_output_7), .MXU_27(inst29_output_7),
    .MXU_28(inst30_output_7), .MXU_29(inst31_output_7), .MXU_30(inst32_output_7), .MXU_31(inst33_output_7),
    .S4(DISP9), .S3(DISP8), .S2(DISP7), .S1(DISP6), .S0(DISP5), .ENABLE(1'b1), .OUTPUT(Db15));
  \32_1_MUX  inst58 (
    .MXU_0(inst2_output_0), .MXU_1(inst3_output_0), .MXU_2(inst4_output_0), .MXU_3(inst5_output_0),
    .MXU_4(inst6_output_0), .MXU_5(inst7_output_0), .MXU_6(inst8_output_0), .MXU_7(inst9_output_0),
    .MXU_8(inst10_output_0), .MXU_9(inst11_output_0), .MXU_10(inst12_output_0), .MXU_11(inst13_output_0),
    .MXU_12(inst14_output_0), .MXU_13(inst15_output_0), .MXU_14(inst16_output_0), .MXU_15(inst17_output_0),
    .MXU_16(inst18_output_0), .MXU_17(inst19_output_0), .MXU_18(inst20_output_0), .MXU_19(inst21_output_0),
    .MXU_20(inst22_output_0), .MXU_21(inst23_output_0), .MXU_22(inst24_output_0), .MXU_23(inst25_output_0),
    .MXU_24(inst26_output_0), .MXU_25(inst27_output_0), .MXU_26(inst28_output_0), .MXU_27(inst29_output_0),
    .MXU_28(inst30_output_0), .MXU_29(inst31_output_0), .MXU_30(inst32_output_0), .MXU_31(inst33_output_0),
    .S4(DISP4), .S3(DISP3), .S2(DISP2), .S1(DISP1), .S0(DISP0), .ENABLE(1'b1), .OUTPUT(Db0));
  \32_1_MUX  inst59 (
    .MXU_0(inst2_output_1), .MXU_1(inst3_output_1), .MXU_2(inst4_output_1), .MXU_3(inst5_output_1),
    .MXU_4(inst6_output_1), .MXU_5(inst7_output_1), .MXU_6(inst8_output_1), .MXU_7(inst9_output_1),
    .MXU_8(inst10_output_1), .MXU_9(inst11_output_1), .MXU_10(inst12_output_1), .MXU_11(inst13_output_1),
    .MXU_12(inst14_output_1), .MXU_13(inst15_output_1), .MXU_14(inst16_output_1), .MXU_15(inst17_output_1),
    .MXU_16(inst18_output_1), .MXU_17(inst19_output_1), .MXU_18(inst20_output_1), .MXU_19(inst21_output_1),
    .MXU_20(inst22_output_1), .MXU_21(inst23_output_1), .MXU_22(inst24_output_1), .MXU_23(inst25_output_1),
    .MXU_24(inst26_output_1), .MXU_25(inst27_output_1), .MXU_26(inst28_output_1), .MXU_27(inst29_output_1),
    .MXU_28(inst30_output_1), .MXU_29(inst31_output_1), .MXU_30(inst32_output_1), .MXU_31(inst33_output_1),
    .S4(DISP4), .S3(DISP3), .S2(DISP2), .S1(DISP1), .S0(DISP0), .ENABLE(1'b1), .OUTPUT(Db1));
  \32_1_MUX  inst60 (
    .MXU_0(inst2_output_2), .MXU_1(inst3_output_2), .MXU_2(inst4_output_2), .MXU_3(inst5_output_2),
    .MXU_4(inst6_output_2), .MXU_5(inst7_output_2), .MXU_6(inst8_output_2), .MXU_7(inst9_output_2),
    .MXU_8(inst10_output_2), .MXU_9(inst11_output_2), .MXU_10(inst12_output_2), .MXU_11(inst13_output_2),
    .MXU_12(inst14_output_2), .MXU_13(inst15_output_2), .MXU_14(inst16_output_2), .MXU_15(inst17_output_2),
    .MXU_16(inst18_output_2), .MXU_17(inst19_output_2), .MXU_18(inst20_output_2), .MXU_19(inst21_output_2),
    .MXU_20(inst22_output_2), .MXU_21(inst23_output_2), .MXU_22(inst24_output_2), .MXU_23(inst25_output_2),
    .MXU_24(inst26_output_2), .MXU_25(inst27_output_2), .MXU_26(inst28_output_2), .MXU_27(inst29_output_2),
    .MXU_28(inst30_output_2), .MXU_29(inst31_output_2), .MXU_30(inst32_output_2), .MXU_31(inst33_output_2),
    .S4(DISP4), .S3(DISP3), .S2(DISP2), .S1(DISP1), .S0(DISP0), .ENABLE(1'b1), .OUTPUT(Db2));
